# Altium project PROC154E3_SCH.PrjPcb (part 12 of 60)

## Sheet 19. SOC MCU RGMII & MMC & ADCs.SchDoc: SOC - MCU RGMII / MMC[0:1] / MCU ADC
size 513 x 386 mm; Project: PROC154E2(001)_SK_AM69; Issue: 1.0; RevCode: E3; Page Create Date: March  8, 1995; Variant Name: Core Design; Schematic Page Number: 19; Page Number: 19; Page Size: C; Comment: MISTRAL_TITLEBLK_CSIZE_1; Page Count: 62; Schematic Page Count: 62; Name: PROC154E2 001 SK AM69; DsnPath: C:\Users\danie\Downloads\sprr466c\PROC154E3_RP\PROC154E3_SCH.DSN; SchematicName: SCHEMATIC1; PageName: 19. SOC MCU RGMII & MMC & ADCs; PageSize: C; TopSchematic: True
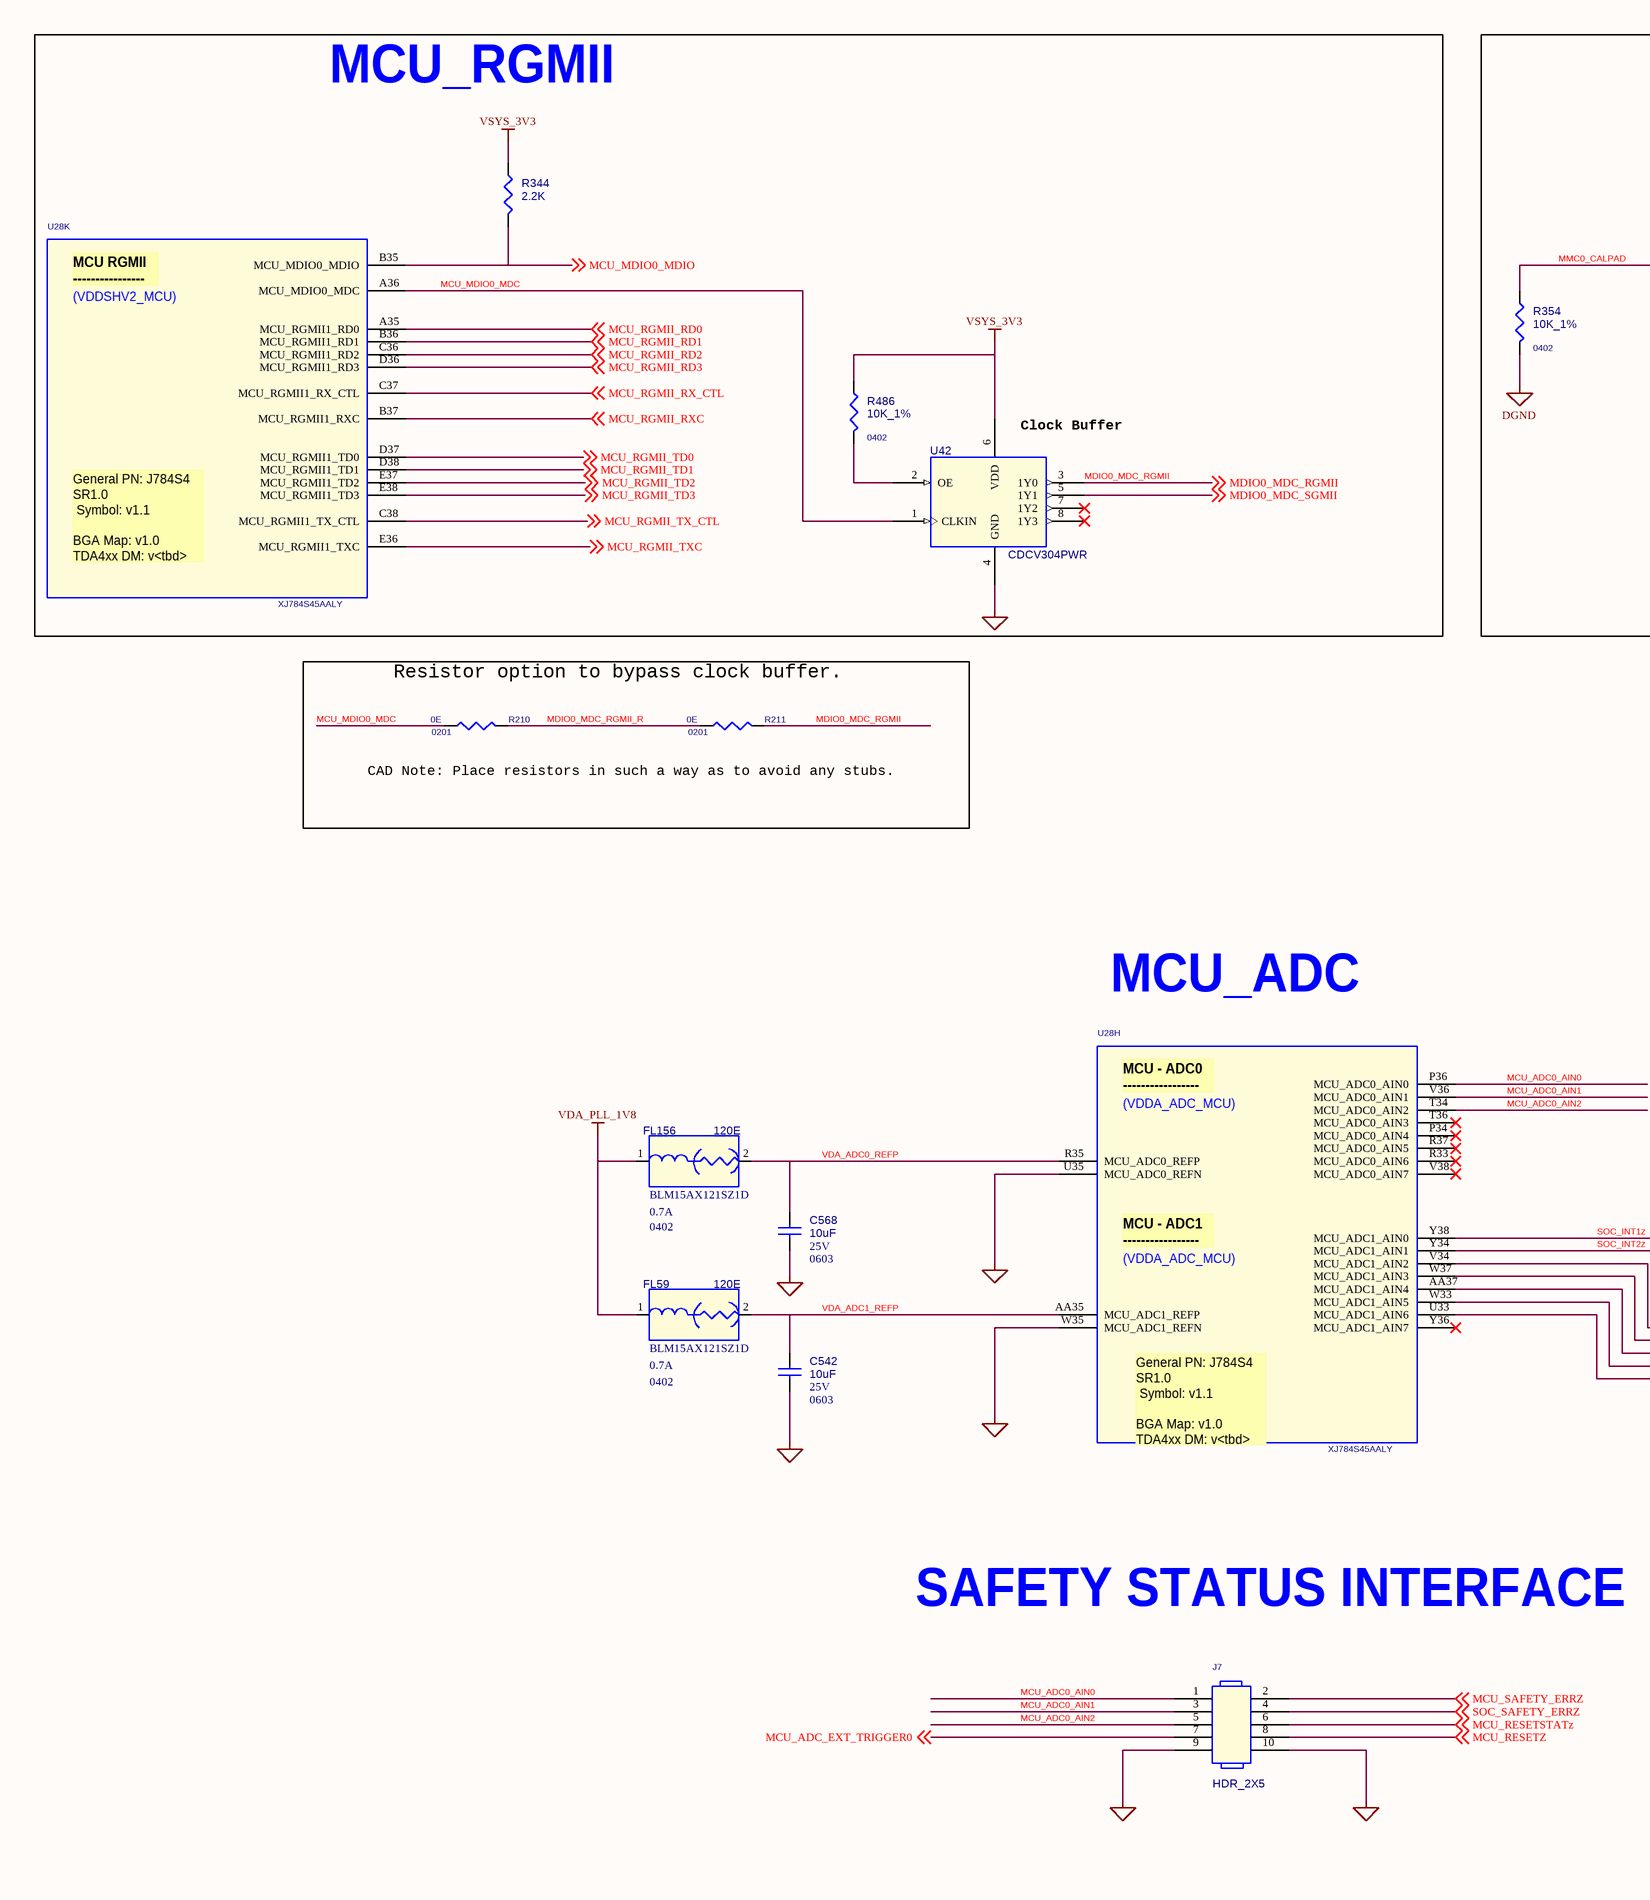
[diagram p27: 19. SOC MCU RGMII & MMC & ADCs.SchDoc, left]
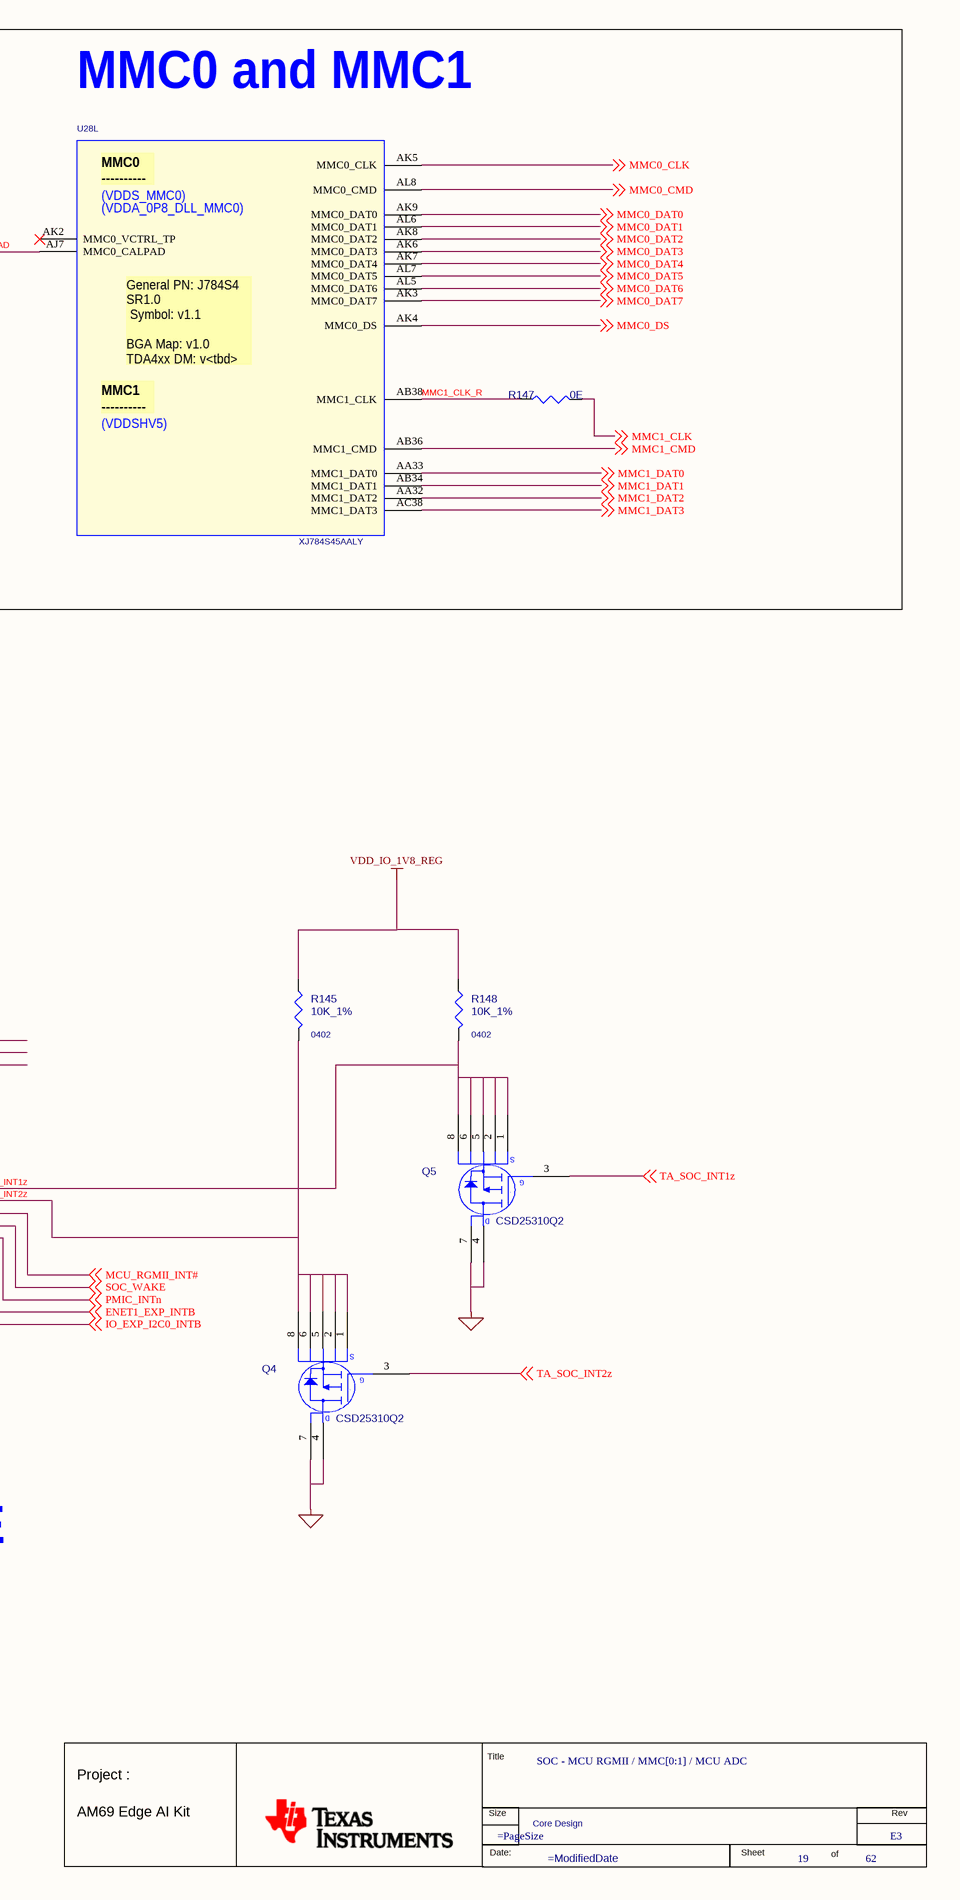
[diagram p28: 19. SOC MCU RGMII & MMC & ADCs.SchDoc, right]

### Parts
(Parts that share a designator on the sheet are numbered #1, #2 ... from top to bottom, then left to right.)
*#19  RevCode: E3  Title: SOC - MCU RGMII / MMC[0:1] / MCU ADC  Page Number: 19  Page Count: 62  Variant Name: Core Design  (hidden comment: MISTRAL_TITLEBLK_CSIZE_1)  (graphical)
C542  10uF  Voltage: 25V  Package: 0603  [CAP0603_1-25]
C568  10uF  Package: 0603  Voltage: 25V  [CAP0603_1-25]
FL59  120E  Mfr_part_number: BLM15AX121SZ1D  Package: 0402  SAT Current: 0.7A  [EMIFIL_BLM15A_0402_0-6]
FL156  120E  Mfr_part_number: BLM15AX121SZ1D  Package: 0402  SAT Current: 0.7A  [EMIFIL_BLM15A_0402_0-6]
J7  HDR_2X5  [HDR_5X2_100_S_S_9-7]
Q4  CSD25310Q2  [SON6_CSD17313Q2_80X80]
Q5  CSD25310Q2  [SON6_CSD17313Q2_80X80]
R145  10K_1%  Package: 0402  [RES0402_0-5]
R147  0E  [RES0402_0-5]
R148  10K_1%  Package: 0402  [RES0402_0-5]
R210  0E  Package: 0201  [RES0201_0-5]
R211  0E  Package: 0201  [RES0201_0-5]
R344  2.2K  [RES0201_0-5]
R354  10K_1%  Package: 0402  [RES0402_0-5]
R486  10K_1%  Package: 0402  [RES0402_0-5]
U28  XJ784S45AALY  [BGA1414_31-49_1230X1230_2-7]  (parts H,K,L of 26)
U42  CDCV304PWR  [TSSOP8_25-59_125X180_1-2]

### Blocks framed on the sheet
MCU_RGMII: R344 R486 U28 U42
MMC0 and MMC1: R147 R354 U28
Resistor option to bypass clock buffer.: R210 R211

### Nets
DGND: C542.2 C568.2 J7.9 J7.10 Q4.4(D1) Q4.7(D2) Q5.4(D1) Q5.7(D2) R354.2 U28.U35(MCU_ADC0_REFN) U28.W35(MCU_ADC1_REFN) U42.4(GND)  [project net VDD_CPU_HCPS_GOSNS]
VDA_PLL_1V8: FL59.1 FL156.1  [project net VDA_MCU_1V8]
VDD_IO_1V8_REG: R145.1 R148.1
VSYS_3V3: R344.1 R486.1 U42.6(VDD)  [project net V_3V3]
ENET1_EXP_INTB: U28.W33(MCU_ADC1_AIN5) ; off-sheet ENET1_EXP_INTB
IO_EXP_I2C0_INTB: U28.U33(MCU_ADC1_AIN6) ; off-sheet IO_EXP_I2C0_INTB
MCU_ADC0_AIN0: J7.1 U28.P36(MCU_ADC0_AIN0)
MCU_ADC0_AIN1: J7.3 U28.V36(MCU_ADC0_AIN1)
MCU_ADC0_AIN2: J7.5 U28.T34(MCU_ADC0_AIN2)
MCU_ADC_EXT_TRIGGER0: J7.7 ; off-sheet MCU_ADC_EXT_TRIGGER0
MCU_MDIO0_MDC: R210.2 U28.A36(MCU_MDIO0_MDC) U42.1(CLKIN)
MCU_MDIO0_MDIO: R344.2 U28.B35(MCU_MDIO0_MDIO) ; off-sheet MCU_MDIO0_MDIO
MCU_RESETSTATZ: J7.6 ; off-sheet MCU_RESETSTATz
MCU_RESETZ: J7.8 ; off-sheet MCU_RESETZ
MCU_RGMII_INT#: U28.V34(MCU_ADC1_AIN2) ; off-sheet MCU_RGMII_INT#
MCU_RGMII_RD0: U28.A35(MCU_RGMII1_RD0) ; off-sheet MCU_RGMII_RD0
MCU_RGMII_RD1: U28.B36(MCU_RGMII1_RD1) ; off-sheet MCU_RGMII_RD1
MCU_RGMII_RD2: U28.C36(MCU_RGMII1_RD2) ; off-sheet MCU_RGMII_RD2
MCU_RGMII_RD3: U28.D36(MCU_RGMII1_RD3) ; off-sheet MCU_RGMII_RD3
MCU_RGMII_RX_CTL: U28.C37(MCU_RGMII1_RX_CTL) ; off-sheet MCU_RGMII_RX_CTL
MCU_RGMII_RXC: U28.B37(MCU_RGMII1_RXC) ; off-sheet MCU_RGMII_RXC
MCU_RGMII_TD0: U28.D37(MCU_RGMII1_TD0) ; off-sheet MCU_RGMII_TD0
MCU_RGMII_TD1: U28.D38(MCU_RGMII1_TD1) ; off-sheet MCU_RGMII_TD1
MCU_RGMII_TD2: U28.E37(MCU_RGMII1_TD2) ; off-sheet MCU_RGMII_TD2
MCU_RGMII_TD3: U28.E38(MCU_RGMII1_TD3) ; off-sheet MCU_RGMII_TD3
MCU_RGMII_TX_CTL: U28.C38(MCU_RGMII1_TX_CTL) ; off-sheet MCU_RGMII_TX_CTL
MCU_RGMII_TXC: U28.E36(MCU_RGMII1_TXC) ; off-sheet MCU_RGMII_TXC
MCU_SAFETY_ERRZ: J7.2 ; off-sheet MCU_SAFETY_ERRZ
MDIO0_MDC_RGMII: R211.1 U42.3(1Y0) ; off-sheet MDIO0_MDC_RGMII
MDIO0_MDC_RGMII_R: R210.1 R211.2
MDIO0_MDC_SGMII: U42.5(1Y1) ; off-sheet MDIO0_MDC_SGMII
MMC0_CALPAD: R354.1 U28.AJ7(MMC0_CALPAD)
MMC0_CLK: U28.AK5(MMC0_CLK) ; off-sheet MMC0_CLK
MMC0_CMD: U28.AL8(MMC0_CMD) ; off-sheet MMC0_CMD
MMC0_DAT0: U28.AK9(MMC0_DAT0) ; off-sheet MMC0_DAT0
MMC0_DAT1: U28.AL6(MMC0_DAT1) ; off-sheet MMC0_DAT1
MMC0_DAT2: U28.AK8(MMC0_DAT2) ; off-sheet MMC0_DAT2
MMC0_DAT3: U28.AK6(MMC0_DAT3) ; off-sheet MMC0_DAT3
MMC0_DAT4: U28.AK7(MMC0_DAT4) ; off-sheet MMC0_DAT4
MMC0_DAT5: U28.AL7(MMC0_DAT5) ; off-sheet MMC0_DAT5
MMC0_DAT6: U28.AL5(MMC0_DAT6) ; off-sheet MMC0_DAT6
MMC0_DAT7: U28.AK3(MMC0_DAT7) ; off-sheet MMC0_DAT7
MMC0_DS: U28.AK4(MMC0_DS) ; off-sheet MMC0_DS
MMC1_CLK: R147.2 ; off-sheet MMC1_CLK
MMC1_CLK_R: R147.1 U28.AB38(MMC1_CLK)
MMC1_CMD: U28.AB36(MMC1_CMD) ; off-sheet MMC1_CMD
MMC1_DAT0: U28.AA33(MMC1_DAT0) ; off-sheet MMC1_DAT0
MMC1_DAT1: U28.AB34(MMC1_DAT1) ; off-sheet MMC1_DAT1
MMC1_DAT2: U28.AA32(MMC1_DAT2) ; off-sheet MMC1_DAT2
MMC1_DAT3: U28.AC38(MMC1_DAT3) ; off-sheet MMC1_DAT3
PMIC_INTn: U28.AA37(MCU_ADC1_AIN4) ; off-sheet PMIC_INTn
SOC_INT1z: Q5.1(S1) Q5.2(S2) Q5.5(S3) Q5.6(S4) Q5.8(S5) R148.2 U28.Y38(MCU_ADC1_AIN0)
SOC_INT2z: Q4.1(S1) Q4.2(S2) Q4.5(S3) Q4.6(S4) Q4.8(S5) R145.2 U28.Y34(MCU_ADC1_AIN1)
SOC_SAFETY_ERRZ: J7.4 ; off-sheet SOC_SAFETY_ERRZ
SOC_WAKE: U28.W37(MCU_ADC1_AIN3) ; off-sheet SOC_WAKE
TA_SOC_INT1z: Q5.3(G) ; off-sheet TA_SOC_INT1z
TA_SOC_INT2z: Q4.3(G) ; off-sheet TA_SOC_INT2z
VDA_ADC0_REFP: C568.1 FL156.2 U28.R35(MCU_ADC0_REFP)
VDA_ADC1_REFP: C542.1 FL59.2 U28.AA35(MCU_ADC1_REFP)
NetR486_2: R486.2 U42.2(OE)

Not connected (* = marked no-connect by the designer): U28 AK2(MMC0_VCTRL_TP)* P34(MCU_ADC0_AIN4)* R33(MCU_ADC0_AIN6)* R37(MCU_ADC0_AIN5)* T36(MCU_ADC0_AIN3)* V38(MCU_ADC0_AIN7)* Y36(MCU_ADC1_AIN7)*; U42 7(1Y2)* 8(1Y3)*

### Notes on the sheet
- (near U42) Clock Buffer
- CAD Note: Place resistors in such a way as to avoid any stubs.
- MCU_ADC
- SAFETY STATUS INTERFACE
- (in symbol J7AHPSoC-EVM_BGA1414, part H) MCU - ADC0 / -----------------; (VDDA_ADC_MCU); MCU - ADC1 / -----------------; General PN: J784S4 / SR1.0 / Symbol: v1.1 / BGA Map: v1.0 / TDA4xx DM: v<tbd>
- (in symbol J7AHPSoC-EVM_BGA1414, part K) MCU RGMII / ----------------; (VDDSHV2_MCU); General PN: J784S4 / SR1.0 / Symbol: v1.1 / BGA Map: v1.0 / TDA4xx DM: v<tbd>
- (in symbol J7AHPSoC-EVM_BGA1414, part L) MMC0 / ----------; (VDDS_MMC0); (VDDA_0P8_DLL_MMC0); General PN: J784S4 / SR1.0 / Symbol: v1.1 / BGA Map: v1.0 / TDA4xx DM: v<tbd>; MMC1 / ----------; (VDDSHV5)
- (in symbol MISTRAL_TITLEBLK_CSIZE_1) Title; Project :; Size; Rev; AM69 Edge AI Kit; Date:; Sheet; of
- (in symbol MOSFET_CSD25310Q2) S; D

### Library data of the parts
*#19 = MISTRAL_TITLEBLK_CSIZE_1: Issue: 1.0; Project: PROC154E2(001)_SK_AM69; Name: PROC154E2 001 SK AM69; Page Create Date: March  8, 1995; Page Size: =PageSize; Page Modify Date: =ModifiedDate; Schematic Page Count: 62; Schematic Page Number: 19
C542 = CAP_Dup1: CAP CERAMIC 10uF 25V 20% X5R 0603; Part Reference: C542; Mistral Part No: 120018070001-R; Mfr_name: MURATA; Mfr_part_number: ZRB18AR61E106ME01L; Part_type: CAPACITORS\CERAMIC; Direct Alternate_mfr_name: SAMSUNG; Direct Alternate_mfr_part_number: CL10X106MO8NRNC; Automotive Alternate_mfr_part_number: GRT188C81C106ME13D; Project: CABS_VME_DIO; Wattage: NA; Customs_HS_Code: 85322990; Custom_Duty: 15%; Value: 10uF; Tolerance: 20%; Distributor_name: DIGIKEY; Distributor_part_number: 490-10991-1-ND; Library Ref: CAP; Height: 1.20MM; Weight: 2mg; Temperature: -55°C+85°C; Datasheet: Y:\MIS_DATABASE\DATASHEETS\CAPACITORS\ZRB18AR61E106ME01L.PDF; Crtd /date: MANIRAJA/040718; Chkd/date: MANIRAJA/040718; MECHANICAL 3D STEP FILE: CAP0603_1-25; Footprint Ref: CAP0603_1-25; Library Path: Y:\MIS_DATABASE\Library\ALTIUM_TOOL\SCHEMATICS_PARTS\MS_DISCRETE_Library.schlib; Footprint Path: Y:\MIS_DATABASE\Library\ALTIUM_TOOL\PCB_FOOTPRINTS\Altium_Footprint_Lib.PcbLib; Automotive Alternate_mfr_name: MURATA; Manufacturer: MURATA; PCB Footprint: CAP0603_1-25
C568 = CAP_Dup1: CAP CERAMIC 10uF 25V 20% X5R 0603; Part Reference: C568; Automotive Alternate_mfr_part_number: GRT188C81C106ME13D; Automotive Alternate_mfr_name: MURATA; Direct Alternate_mfr_part_number: CL10X106MO8NRNC; Direct Alternate_mfr_name: SAMSUNG; Part_type: CAPACITORS\CERAMIC; Mfr_part_number: ZRB18AR61E106ME01L; Mistral Part No: 120018070001-R; Custom_Duty: 15%; Customs_HS_Code: 85322990; Wattage: NA; Project: CABS_VME_DIO; Value: 10uF; Footprint Path: Y:\MIS_DATABASE\Library\ALTIUM_TOOL\PCB_FOOTPRINTS\Altium_Footprint_Lib.PcbLib; Library Path: Y:\MIS_DATABASE\Library\ALTIUM_TOOL\SCHEMATICS_PARTS\MS_DISCRETE_Library.schlib; Footprint Ref: CAP0603_1-25; MECHANICAL 3D STEP FILE: CAP0603_1-25; Chkd/date: MANIRAJA/040718; Crtd /date: MANIRAJA/040718; Datasheet: Y:\MIS_DATABASE\DATASHEETS\CAPACITORS\ZRB18AR61E106ME01L.PDF; Temperature: -55°C+85°C; Weight: 2mg; Height: 1.20MM; Library Ref: CAP; Distributor_part_number: 490-10991-1-ND; Distributor_name: DIGIKEY; Tolerance: 20%; Mfr_name: MURATA; Manufacturer: MURATA; PCB Footprint: CAP0603_1-25
FL59 = EMIFILTER_IND: IND FERRITE BEAD CHIP 120E 700mA 0402; Part Reference: FL59; Manufacturer: MURATA; Automotive Alternate_mfr_part_number: MPZ1608S121ATDH5; Automotive Alternate_mfr_name: TDK; Direct Alternate_mfr_part_number: MPZ1608S121ATAH0; Mistral Part No: 130022010017-R; Part_type: INDUCTOR; Project: J7AHP_PROTO_BRD; Tolerance: 25%; Voltage: NA; Customs_HS_Code: 85437099; Custom_Duty: 24%; Value: 120E; PCB Footprint: EMIFIL_BLM15A_0402_0-6; Direct Alternate_mfr_name: TDK; Footprint Ref: EMIFIL_BLM15A_0402_0-6; Mfr_name: MURATA; Wattage: NA; Distributor_name: DIGIKEY; Distributor_part_number: 490-16510-1-ND; Library Ref: EMIFILTER_IND; Height: 0.55MM; Weight: 1mg; Temperature: -55°C+125°C; Datasheet: Y:\MIS_DATABASE\DATASHEETS\DISCRETES\INDUCTORS\BLM15-SZ1D-SER.PDF; Crtd /date: TAMILARASU/170122; Chkd/date: MANIRAJA/170122; MECHANICAL 3D STEP FILE: EMIFIL_BLM15A_0402_0-6; Library Path: Y:\MIS_DATABASE\Library\ALTIUM_TOOL\SCHEMATICS_PARTS\MS_FILTER_Library.schlib; Footprint Path: Y:\MIS_DATABASE\Library\ALTIUM_TOOL\PCB_FOOTPRINTS\Altium_Footprint_Lib.PcbLib
FL156 = EMIFILTER_IND: IND FERRITE BEAD CHIP 120E 700mA 0402; Part Reference: FL156; Manufacturer: MURATA; Automotive Alternate_mfr_part_number: MPZ1608S121ATDH5; Automotive Alternate_mfr_name: TDK; Direct Alternate_mfr_part_number: MPZ1608S121ATAH0; Mistral Part No: 130022010017-R; Part_type: INDUCTOR; Project: J7AHP_PROTO_BRD; Tolerance: 25%; Voltage: NA; Customs_HS_Code: 85437099; Custom_Duty: 24%; Value: 120E; PCB Footprint: EMIFIL_BLM15A_0402_0-6; Direct Alternate_mfr_name: TDK; Footprint Ref: EMIFIL_BLM15A_0402_0-6; Mfr_name: MURATA; Wattage: NA; Distributor_name: DIGIKEY; Distributor_part_number: 490-16510-1-ND; Library Ref: EMIFILTER_IND; Height: 0.55MM; Weight: 1mg; Temperature: -55°C+125°C; Datasheet: Y:\MIS_DATABASE\DATASHEETS\DISCRETES\INDUCTORS\BLM15-SZ1D-SER.PDF; Crtd /date: TAMILARASU/170122; Chkd/date: MANIRAJA/170122; MECHANICAL 3D STEP FILE: EMIFIL_BLM15A_0402_0-6; Library Path: Y:\MIS_DATABASE\Library\ALTIUM_TOOL\SCHEMATICS_PARTS\MS_FILTER_Library.schlib; Footprint Path: Y:\MIS_DATABASE\Library\ALTIUM_TOOL\PCB_FOOTPRINTS\Altium_Footprint_Lib.PcbLib
J7 = HEADER_5X2: CON HDR 2X5 2.54MM PITCH ST SMD; Part Reference: J7; Part_type: CONNECTOR\HEADERS; Mfr_part_number: TSM-105-01-L-DV; Mfr_name: SAMTEC; Mistral Part No: 150009030265-R; Custom_Duty: 24%; Customs_HS_Code: 85369090; Wattage: NA; Project: SMART VIEW_NVR; Value: HDR_2X5; MECHANICAL 3D STEP FILE: HDR_5X2_100_S_S_9-7; Chkd/date: VASANTHA/220317; Crtd /date: MANIRAJA/210317; Datasheet: Y:\MIS_DATABASE\DATASHEETS\CONNECTORS\TSM-103-02-L-DV.PDF; Temperature: -55°C+125°C; Weight: NA; Height: 9.65MM; Library Ref: HEADER_5X2; Distributor_part_number: SAM8984-ND; Distributor_name: DIGIKEY; Package: SMD; Voltage: NA; Tolerance: NA; PCB Footprint: HDR_5X2_100_S_S_9-7
Q4 = MOSFET_CSD25310Q2: IC MOSFET P-CHANNEL WSON6; Part Reference: Q4; Part_type: ICS\POWER\MOSFET; Mfr_name: TEXAS INSTRUMENTS; Mistral Part No: 142015120011-R; Custom_Duty: 15%; Customs_HS_Code: 85423100; Wattage: NA; Project: DUET BOARD; Value: CSD25310Q2; Chkd/date: VASANTHA/191215; Crtd /date: VASANTHA/191215; Datasheet: Y:\MIS_DATABASE\DATASHEETS\DISCRETES\TRANSISTORS_FETS\CSD25310Q2.PDF; Temperature: -55°C+150°C; Weight: NA; Height: 0.85MM; Library Ref: MOSFET_CSD25310Q2; Distributor_part_number: 296-38915-1-ND; Distributor_name: DIGIKEY; Package: WSON6; Voltage: NA; Tolerance: NA; Mfr_part_number: CSD25310Q2; PCB Footprint: SON6_CSD17313Q2_80X80
Q5 = MOSFET_CSD25310Q2: IC MOSFET P-CHANNEL WSON6; Part Reference: Q5; Part_type: ICS\POWER\MOSFET; Mfr_name: TEXAS INSTRUMENTS; Mistral Part No: 142015120011-R; Custom_Duty: 15%; Customs_HS_Code: 85423100; Wattage: NA; Project: DUET BOARD; Value: CSD25310Q2; Chkd/date: VASANTHA/191215; Crtd /date: VASANTHA/191215; Datasheet: Y:\MIS_DATABASE\DATASHEETS\DISCRETES\TRANSISTORS_FETS\CSD25310Q2.PDF; Temperature: -55°C+150°C; Weight: NA; Height: 0.85MM; Library Ref: MOSFET_CSD25310Q2; Distributor_part_number: 296-38915-1-ND; Distributor_name: DIGIKEY; Package: WSON6; Voltage: NA; Tolerance: NA; Mfr_part_number: CSD25310Q2; PCB Footprint: SON6_CSD17313Q2_80X80
R145 = RESISTOR_Dup2: RES 10K 1/16W 1% 0402; Part Reference: R145; Part_type: RESISTORS\FIXED; Mfr_part_number: RC0402FR-0710KL; Mfr_name: YAGEO AMERICA; Mistral Part No: 110015090015-R; Custom_Duty: 15%; Customs_HS_Code: 85332119; Voltage: NA; Project: VOCERA; Value: 10K_1%; Footprint Path: Y:\MIS_DATABASE\Library\ALTIUM_TOOL\PCB_FOOTPRINTS\Altium_Footprint_Lib.PcbLib; Library Path: Y:\MIS_DATABASE\Library\ALTIUM_TOOL\SCHEMATICS_PARTS\MS_DISCRETE_Library.schlib; MECHANICAL 3D STEP FILE: RES0402_0-5; Chkd/date: VASANTHA/201216; Crtd /date: GEETHA/290506; Datasheet: Y:\MIS_DATABASE\DATASHEETS\RESISTORS\RCXXXXL-SER_MAR18.PDF; Temperature: -55°C+155°C; Weight: 0.65mg; Height: 0.40MM; Library Ref: RESISTOR; Distributor_part_number: 311-10.0KLRTR-ND; Distributor_name: DIGIKEY; Wattage: 1/16W; Tolerance: 1%; Footprint Ref: RES0402_0-5; Manufacturer: YAGEO AMERICA; PCB Footprint: RES0402_0-5
R147 = RESISTOR_Dup2: RES 0E 1/10W JUMPER 0402; Part Reference: R147; Manufacturer: PANASONIC-ECG; Mistral Part No: 110018030052-R; Mfr_part_number: ERJ-2GE0R00X; Part_type: RESISTORS\FIXED; IBISSP_MODLES: VALUE REPEATING 2 TIME; Project: AEGIS POM; Tolerance: NA; Customs_HS_Code: 85332119; Custom_Duty: 15%; SIGNAL_MODEL: RESISTOR_RES0402_0-5_0E_0E; Value: 0E; Footprint Path: Y:\MIS_DATABASE\Library\ALTIUM_TOOL\PCB_FOOTPRINTS\Altium_Footprint_Lib.PcbLib; Library Path: Y:\MIS_DATABASE\Library\ALTIUM_TOOL\SCHEMATICS_PARTS\MS_DISCRETE_Library.schlib; MECHANICAL 3D STEP FILE: RES0402_0-5; Footprint Ref: RES0402_0-5; Mfr_name: PANASONIC-ECG; Voltage: NA; Wattage: 1/10W; Package: 0402; Distributor_name: DIGIKEY; Distributor_part_number: P0.0JCT-ND; Library Ref: RESISTOR; Height: 0.40MM; Weight: 0.8mg; Temperature: -55°C+155°C; Datasheet: Y:\MIS_DATABASE\DATASHEETS\RESISTORS\PAN-ERJSER_NOV17.PDF; Crtd /date: NAVEED/201014; Chkd/date: VASANTHA/061216; PCB Footprint: RES0402_0-5
R148 = RESISTOR_Dup2: RES 10K 1/16W 1% 0402; Part Reference: R148; Manufacturer: YAGEO AMERICA; Mistral Part No: 110015090015-R; Mfr_part_number: RC0402FR-0710KL; Part_type: RESISTORS\FIXED; Project: VOCERA; Voltage: NA; Customs_HS_Code: 85332119; Custom_Duty: 15%; Value: 10K_1%; Footprint Ref: RES0402_0-5; Mfr_name: YAGEO AMERICA; Tolerance: 1%; Wattage: 1/16W; Distributor_name: DIGIKEY; Distributor_part_number: 311-10.0KLRTR-ND; Library Ref: RESISTOR; Height: 0.40MM; Weight: 0.65mg; Temperature: -55°C+155°C; Datasheet: Y:\MIS_DATABASE\DATASHEETS\RESISTORS\RCXXXXL-SER_MAR18.PDF; Crtd /date: GEETHA/290506; Chkd/date: VASANTHA/201216; MECHANICAL 3D STEP FILE: RES0402_0-5; Library Path: Y:\MIS_DATABASE\Library\ALTIUM_TOOL\SCHEMATICS_PARTS\MS_DISCRETE_Library.schlib; Footprint Path: Y:\MIS_DATABASE\Library\ALTIUM_TOOL\PCB_FOOTPRINTS\Altium_Footprint_Lib.PcbLib; PCB Footprint: RES0402_0-5
R210 = RESISTOR: RES 0E 1/20W 5% 0201; Part Reference: R210; Mistral Part No: 110010070067-R; Mfr_name: YAGEO AMERICA; Mfr_part_number: RC0201JR-070RL; Part_type: RESISTORS\FIXED; Project: PB_BUGBASE; Voltage: NA; Customs_HS_Code: 85332119; Custom_Duty: 15%; Value: 0E; Footprint Ref: RES0201_0-5; Tolerance: 5%; Wattage: 1/20W; Distributor_name: DIGIKEY; Distributor_part_number: 311-0.0NCT-ND; Library Ref: RESISTOR; Height: 0.26MM; Weight: 0.17mg; Temperature: -55°C+125°C; Datasheet: Y:\MIS_DATABASE\DATASHEETS\RESISTORS\RCXXXXL-SER_MAR18.PDF; Crtd /date: MUDDU/120710; Chkd/date: NAVEED/301214; MECHANICAL 3D STEP FILE: RES0201_0-5; Library Path: Y:\MIS_DATABASE\Library\ALTIUM_TOOL\SCHEMATICS_PARTS\MS_DISCRETE_Library.schlib; Footprint Path: Y:\MIS_DATABASE\Library\ALTIUM_TOOL\PCB_FOOTPRINTS\Altium_Footprint_Lib.PcbLib; Manufacturer: YAGEO AMERICA; PCB Footprint: RES0201_0-5
R211 = RESISTOR: RES 0E 1/20W 5% 0201; Part Reference: R211; Manufacturer: YAGEO AMERICA; Mistral Part No: 110010070067-R; Mfr_part_number: RC0201JR-070RL; Part_type: RESISTORS\FIXED; Project: PB_BUGBASE; Voltage: NA; Customs_HS_Code: 85332119; Custom_Duty: 15%; Value: 0E; Footprint Ref: RES0201_0-5; Mfr_name: YAGEO AMERICA; Tolerance: 5%; Wattage: 1/20W; Distributor_name: DIGIKEY; Distributor_part_number: 311-0.0NCT-ND; Library Ref: RESISTOR; Height: 0.26MM; Weight: 0.17mg; Temperature: -55°C+125°C; Datasheet: Y:\MIS_DATABASE\DATASHEETS\RESISTORS\RCXXXXL-SER_MAR18.PDF; Crtd /date: MUDDU/120710; Chkd/date: NAVEED/301214; MECHANICAL 3D STEP FILE: RES0201_0-5; Library Path: Y:\MIS_DATABASE\Library\ALTIUM_TOOL\SCHEMATICS_PARTS\MS_DISCRETE_Library.schlib; Footprint Path: Y:\MIS_DATABASE\Library\ALTIUM_TOOL\PCB_FOOTPRINTS\Altium_Footprint_Lib.PcbLib; PCB Footprint: RES0201_0-5
R344 = RESISTOR_Dup2: RES 2.2K 1/20W 5% 0201; Part Reference: R344; Manufacturer: YAGEO AMERICA; Part_type: RESISTORS\FIXED; Mfr_part_number: RC0201JR-072K2L; Mistral Part No: 110009030427-R; Custom_Duty: 15%; Customs_HS_Code: 85332119; Voltage: NA; Project: GOLDEN-I LITE; Value: 2.2K; PCB Footprint: RES0201_0-5; Footprint Path: Y:\MIS_DATABASE\Library\ALTIUM_TOOL\PCB_FOOTPRINTS\Altium_Footprint_Lib.PcbLib; Library Path: Y:\MIS_DATABASE\Library\ALTIUM_TOOL\SCHEMATICS_PARTS\MS_DISCRETE_Library.schlib; MECHANICAL 3D STEP FILE: RES0201_0-5; Chkd/date: MANIRAJA/050517; Crtd /date: MANIRAJA/050517; Datasheet: Y:\MIS_DATABASE\DATASHEETS\RESISTORS\RCXXXXL-SER_MAR18.PDF; Temperature: -55°C+125°C; Weight: 0.17mg; Height: 0.26MM; Library Ref: RESISTOR; Distributor_part_number: 311-2.2KNCT-ND; Distributor_name: DIGIKEY; Package: 0201; Wattage: 1/20W; Tolerance: 5%; Mfr_name: YAGEO AMERICA; Footprint Ref: RES0201_0-5
R354 = RESISTOR_Dup2: RES 10K 1/16W 1% 0402; Part Reference: R354; Manufacturer: YAGEO AMERICA; Mistral Part No: 110015090015-R; Mfr_part_number: RC0402FR-0710KL; Part_type: RESISTORS\FIXED; Project: VOCERA; Voltage: NA; Customs_HS_Code: 85332119; Custom_Duty: 15%; Value: 10K_1%; Footprint Ref: RES0402_0-5; Mfr_name: YAGEO AMERICA; Tolerance: 1%; Wattage: 1/16W; Distributor_name: DIGIKEY; Distributor_part_number: 311-10.0KLRTR-ND; Library Ref: RESISTOR; Height: 0.40MM; Weight: 0.65mg; Temperature: -55°C+155°C; Datasheet: Y:\MIS_DATABASE\DATASHEETS\RESISTORS\RCXXXXL-SER_MAR18.PDF; Crtd /date: GEETHA/290506; Chkd/date: VASANTHA/201216; MECHANICAL 3D STEP FILE: RES0402_0-5; Library Path: Y:\MIS_DATABASE\Library\ALTIUM_TOOL\SCHEMATICS_PARTS\MS_DISCRETE_Library.schlib; Footprint Path: Y:\MIS_DATABASE\Library\ALTIUM_TOOL\PCB_FOOTPRINTS\Altium_Footprint_Lib.PcbLib; PCB Footprint: RES0402_0-5
R486 = RESISTOR_Dup2: RES 10K 1/16W 1% 0402; Part Reference: R486; Part_type: RESISTORS\FIXED; Mfr_part_number: RC0402FR-0710KL; Mfr_name: YAGEO AMERICA; Mistral Part No: 110015090015-R; Custom_Duty: 15%; Customs_HS_Code: 85332119; Voltage: NA; Project: VOCERA; Value: 10K_1%; Footprint Path: Y:\MIS_DATABASE\Library\ALTIUM_TOOL\PCB_FOOTPRINTS\Altium_Footprint_Lib.PcbLib; Library Path: Y:\MIS_DATABASE\Library\ALTIUM_TOOL\SCHEMATICS_PARTS\MS_DISCRETE_Library.schlib; MECHANICAL 3D STEP FILE: RES0402_0-5; Chkd/date: VASANTHA/201216; Crtd /date: GEETHA/290506; Datasheet: Y:\MIS_DATABASE\DATASHEETS\RESISTORS\RCXXXXL-SER_MAR18.PDF; Temperature: -55°C+155°C; Weight: 0.65mg; Height: 0.40MM; Library Ref: RESISTOR; Distributor_part_number: 311-10.0KLRTR-ND; Distributor_name: DIGIKEY; Wattage: 1/16W; Tolerance: 1%; Footprint Ref: RES0402_0-5; Manufacturer: YAGEO AMERICA; PCB Footprint: RES0402_0-5
U28 = J7AHPSoC-EVM_BGA1414: IC AM69 SoC EVM MICROPROCESSOR BGA1414; Part Reference: U28; Manufacturer: TEXAS INSTRUMENTS; Mistral Part No: 141230020002; Part_type: ICS\DIGITAL\MICROPROCESSOR; SPLIT_INST: TRUE; SWAP_INFO: (S1+S2+S3+S4+S5+S6+S7+S8+S9+S10+S11+S12+S13+S14+S15+S16+S17+S18+S19+S20+S21+S22+S23+S24+S25+S26); Project: TI_J7AHP SK_BRD; Tolerance: NA; Customs_HS_Code: 85423100; Custom_Duty: 15%; Value: XJ784S45AALY; Footprint Ref: BGA1414_31-49_1230X1230_2-7; Mfr_name: TEXAS INSTRUMENTS; Mfr_part_number: XJ784S45AALY; Voltage: NA; Wattage: NA; Package: BGA1414; Distributor_name: NA; Distributor_part_number: NA; Library Ref: J7AHPSoC-EVM_BGA1414; Height: 2.70MM; Weight: NA; Temperature: NA; Datasheet: Y:\MIS_DATABASE\DATASHEETS\ICS\DIGITAL\MICROCONTROLLER\J7AHP-SoC-EVM.PDF; Crtd /date: ALVY/141221; Chkd/date: MANIRAJA/151221; RoHS: NA; MECHANICAL 3D STEP FILE: BGA1414_31-49_1230X1230_2-7; Library Path: Y:\MIS_DATABASE\Library\ALTIUM_TOOL\SCHEMATICS_PARTS\MS_MICROPROCESSOR_Library.schlib; Footprint Path: Y:\MIS_DATABASE\Library\ALTIUM_TOOL\PCB_FOOTPRINTS\Altium_Footprint_Lib.PcbLib; PCB Footprint: BGA1414_31-49_1230X1230_2-7
U42 = CDCV304PW_TSSOP8: IC 200MHz CLOCK BUFFER PCI-X COMPLIANT TSSOP8; Part Reference: U42; Part_type: ICS\DIGITAL\COMBINATIONAL; Mfr_name: TEXAS INSTRUMENTS; Mistral Part No: 141009030060-R; Custom_Duty: 15%; Customs_HS_Code: 85423100; Wattage: NA; Project: SMART VIEW_IP CAMERA; Value: CDCV304PWR; Footprint Path: Y:\MIS_DATABASE\Library\ALTIUM_TOOL\PCB_FOOTPRINTS\Altium_Footprint_Lib.PcbLib; Library Path: Y:\MIS_DATABASE\Library\ALTIUM_TOOL\SCHEMATICS_PARTS\MS_COMBINATIONAL_Library.schlib; MECHANICAL 3D STEP FILE: TSSOP8_25-59_125X180_1-2; Chkd/date: VASANTHA/090217; Crtd /date: MANIRAJA/090217; Datasheet: Y:\MIS_DATABASE\DATASHEETS\ICS\DIGITAL\COMBINATIONAL\CDCV304-OCT2017.PDF; Temperature: -40°C+85°C; Weight: 39mg; Height: 1.20MM; Library Ref: CDCV304PW_TSSOP8; Distributor_part_number: 296-9436-1-ND; Distributor_name: DIGIKEY; Package: TSSOP8; Voltage: NA; Tolerance: NA; Mfr_part_number: CDCV304PWR; Footprint Ref: TSSOP8_25-59_125X180_1-2; PCB Footprint: TSSOP8_25-59_125X180_1-2

## Sheet 20. SOC DEBUG.SchDoc: SOC - DEBUG & VMON
size 513 x 386 mm; Project: PROC154E2(001)_SK_AM69; Issue: 1.0; RevCode: E3; Page Create Date: March  8, 1995; Variant Name: Core Design; Schematic Page Number: 20; Page Number: 20; Page Size: C; Comment: MISTRAL_TITLEBLK_CSIZE_1; Page Count: 62; Schematic Page Count: 62; Name: PROC154E2 001 SK AM69; DsnPath: C:\Users\danie\Downloads\sprr466c\PROC154E3_RP\PROC154E3_SCH.DSN; SchematicName: SCHEMATIC1; PageName: 20. SOC DEBUG; PageSize: C; TopSchematic: True
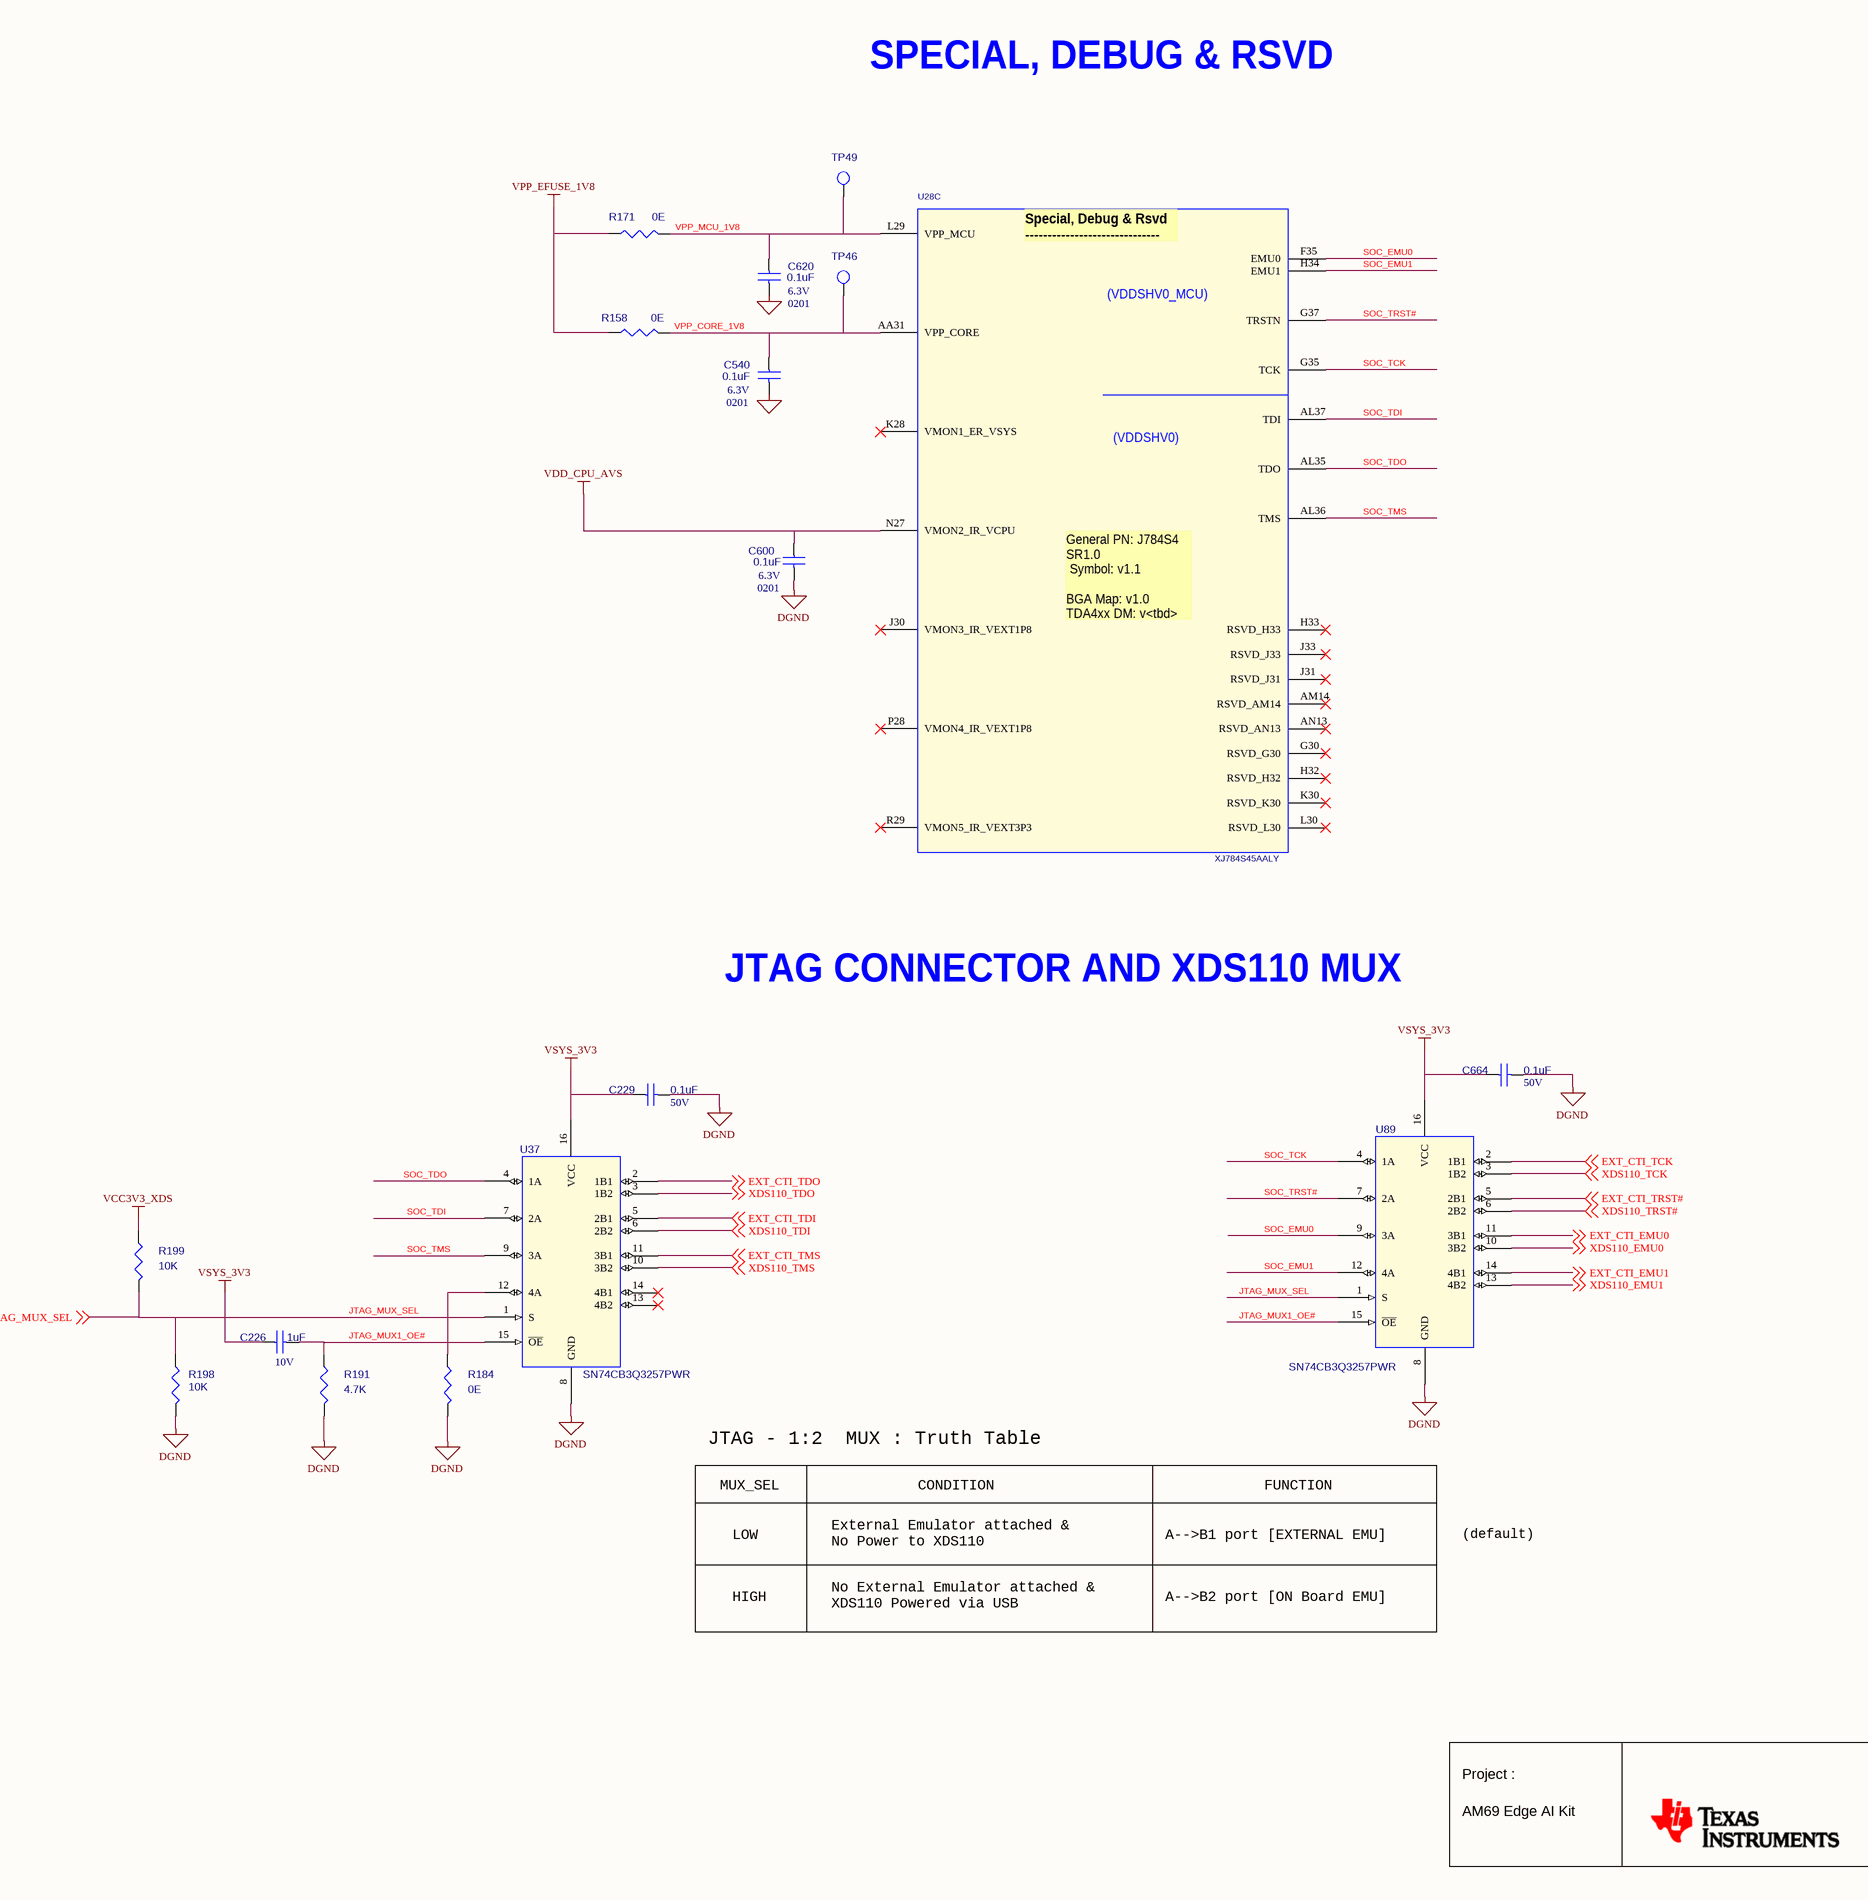
[diagram p29: 20. SOC DEBUG.SchDoc, left]
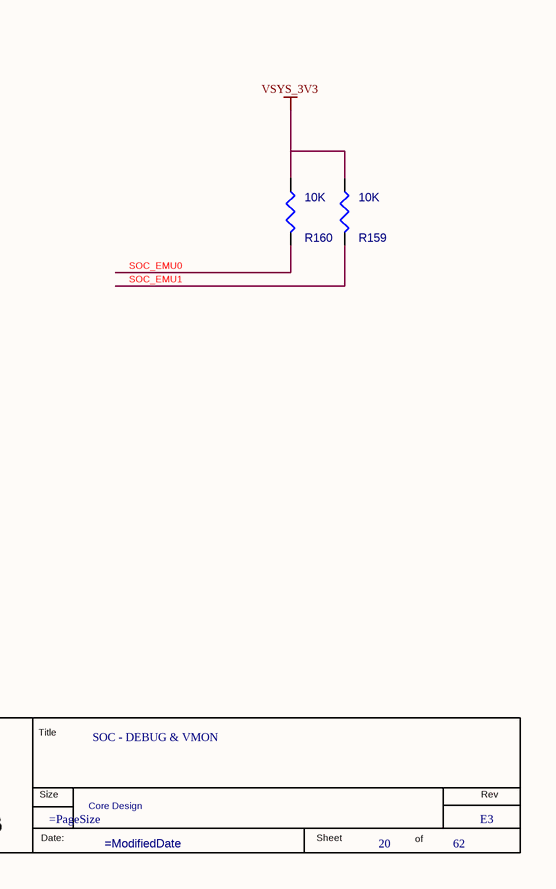
[diagram p30: 20. SOC DEBUG.SchDoc, right]

### Parts
(Parts that share a designator on the sheet are numbered #1, #2 ... from top to bottom, then left to right.)
*#20  RevCode: E3  Title: SOC - DEBUG & VMON  Page Number: 20  Page Count: 62  Variant Name: Core Design  (hidden comment: MISTRAL_TITLEBLK_CSIZE_1)  (graphical)
C226  1uF  Voltage: 10V  [CAP0402_0-75]
C229  0.1uF  Voltage: 50V  [CAP0402_0-75]
C540  0.1uF  Package: 0201  Voltage: 6.3V  [CAP0201_0-5]
C600  0.1uF  Voltage: 6.3V  Package: 0201  [CAP0201_0-5]
C620  0.1uF  Voltage: 6.3V  Package: 0201  [CAP0201_0-5]
C664  0.1uF  Voltage: 50V  [CAP0402_0-75]
R158  0E  [RES0603_0-75]
R159  10K  [RES0402_0-5]
R160  10K  [RES0402_0-5]
R171  0E  [RES0603_0-75]
R184  0E  [RES0402_0-5]
R191  4.7K  [RES0402_0-5]
R198  10K  [RES0402_0-5]
R199  10K  [RES0402_0-5]
TP46  TP30_SMD  [TP30_SMD]  (value not drawn)
TP49  TP30_SMD  [TP30_SMD]  (value not drawn)
U28  XJ784S45AALY  [BGA1414_31-49_1230X1230_2-7]  (part C of 26)
U37  SN74CB3Q3257PWR  [TSSOP16_25-59_205X180]
U89  SN74CB3Q3257PWR  [TSSOP16_25-59_205X180]

### Nets
DGND: C229.2 C540.2 C600.2 C620.2 C664.2 R184.2 R191.2 R198.2 U37.8(GND) U89.8(GND)  [project net VDD_CPU_HCPS_GOSNS]
VCC3V3_XDS: R199.1
VDD_CPU_AVS: C600.1 U28.N27(VMON2_IR_VCPU)  [project net VDD_CPU_HCPS_VOSNS]
VPP_EFUSE_1V8: R158.2 R171.1
VSYS_3V3: C226.1 C229.1 C664.1 R159.1 R160.1 U37.16(VCC) U89.16(VCC)  [project net V_3V3]
EXT_CTI_EMU0: U89.11(3B1) ; off-sheet EXT_CTI_EMU0
EXT_CTI_EMU1: U89.14(4B1) ; off-sheet EXT_CTI_EMU1
EXT_CTI_TCK: U89.2(1B1) ; off-sheet EXT_CTI_TCK
EXT_CTI_TDI: U37.5(2B1) ; off-sheet EXT_CTI_TDI
EXT_CTI_TDO: U37.2(1B1) ; off-sheet EXT_CTI_TDO
EXT_CTI_TMS: U37.11(3B1) ; off-sheet EXT_CTI_TMS
EXT_CTI_TRST#: U89.5(2B1) ; off-sheet EXT_CTI_TRST#
JTAG_MUX1_OE#: C226.2 R191.1 U37.15(~{OE}) U89.15(~{OE})
JTAG_MUX_SEL: R198.1 R199.2 U37.1(S) U89.1(S) ; off-sheet JTAG_MUX_SEL
SOC_EMU0: R160.2 U28.F35(EMU0) U89.9(3A)
SOC_EMU1: R159.2 U28.H34(EMU1) U89.12(4A)
SOC_TCK: U28.G35(TCK) U89.4(1A)
SOC_TDI: U28.AL37(TDI) U37.7(2A)
SOC_TDO: U28.AL35(TDO) U37.4(1A)
SOC_TMS: U28.AL36(TMS) U37.9(3A)
SOC_TRST#: U28.G37(TRSTN) U89.7(2A)
VPP_CORE_1V8: C540.1 R158.1 TP46.1(TP) U28.AA31(VPP_CORE)
VPP_MCU_1V8: C620.1 R171.2 TP49.1(TP) U28.L29(VPP_MCU)
XDS110_EMU0: U89.10(3B2) ; off-sheet XDS110_EMU0
XDS110_EMU1: U89.13(4B2) ; off-sheet XDS110_EMU1
XDS110_TCK: U89.3(1B2) ; off-sheet XDS110_TCK
XDS110_TDI: U37.6(2B2) ; off-sheet XDS110_TDI
XDS110_TDO: U37.3(1B2) ; off-sheet XDS110_TDO
XDS110_TMS: U37.10(3B2) ; off-sheet XDS110_TMS
XDS110_TRST#: U89.6(2B2) ; off-sheet XDS110_TRST#
NetR184_1: R184.1 U37.12(4A)

Not connected (* = marked no-connect by the designer): U28 AM14(RSVD_AM14)* AN13(RSVD_AN13)* G30(RSVD_G30)* H32(RSVD_H32)* H33(RSVD_H33)* J30(VMON3_IR_VEXT1P8)* J31(RSVD_J31)* J33(RSVD_J33)* K28(VMON1_ER_VSYS)* K30(RSVD_K30)* L30(RSVD_L30)* P28(VMON4_IR_VEXT1P8)* R29(VMON5_IR_VEXT3P3)*; U37 13(4B2)* 14(4B1)*

### Notes on the sheet
- SPECIAL, DEBUG & RSVD
- JTAG CONNECTOR AND XDS110 MUX
- JTAG - 1:2  MUX : Truth Table
- MUX_SEL
- External Emulator attached &
  No Power to XDS110
- CONDITION
- FUNCTION
- LOW
- No External Emulator attached &
  XDS110 Powered via USB
- A-->B1 port [EXTERNAL EMU]
- (default)
- HIGH
- A-->B2 port [ON Board EMU]
- (in symbol J7AHPSoC-EVM_BGA1414, part C) Special, Debug & Rsvd / ------------------------------; (VDDSHV0_MCU); (VDDSHV0); General PN: J784S4 / SR1.0 / Symbol: v1.1 / BGA Map: v1.0 / TDA4xx DM: v<tbd>
- (in symbol MISTRAL_TITLEBLK_CSIZE_1) Title; Project :; Size; Rev; AM69 Edge AI Kit; Date:; Sheet; of

### Library data of the parts
*#20 = MISTRAL_TITLEBLK_CSIZE_1: as *#19 on sheet 19. SOC MCU RGMII & MMC & ADCs; Page Create Date: March  8, 1995; Page Size: =PageSize; Page Modify Date: =ModifiedDate; Schematic Page Count: 62; Schematic Page Number: 20
C226 = CAP_Dup1: CAP CERAMIC 1uF 10V 10% X7S AUTO 0402; Part Reference: C226; Mistral Part No: 120018090021-R; Mfr_name: MURATA; Mfr_part_number: GCM155C71A105KE38D; Part_type: CAPACITORS\CERAMIC; Direct Alternate_mfr_name: YAGEO AMERICA; Direct Alternate_mfr_part_number: CC0402KRX5R7BB105; Automotive Alternate_mfr_name: TAIYO YUDEN; Automotive Alternate_mfr_part_number: EMK105BJ105KVHF; Manufacturer: TDK CORPORATION; Project: SMART-M_SCRIPTALK_PB; Wattage: NA; Customs_HS_Code: 85322990; Custom_Duty: 15%; Value: 1uF; PCB Footprint: CAP0402_0-75; Tolerance: 10%; Package: 0402; Distributor_name: DIGIKEY; Distributor_part_number: 490-13409-1-ND; Height: 0.70MM; Weight: 6mg; Temperature: -55°C+125°C; Datasheet: Y:\MIS_DATABASE\DATASHEETS\CAPACITORS\MURATA-GCM-SER.PDF; Crtd /date: ALVY/100918; Chkd/date: MANIRAJA/100918; Library Ref: CAP; MECHANICAL 3D STEP FILE: CAP0402_0-75; Footprint Ref: CAP0402_0-75; Library Path: Y:\MIS_DATABASE\Library\ALTIUM_TOOL\SCHEMATICS_PARTS\MS_DISCRETE_Library.schlib; Footprint Path: Y:\MIS_DATABASE\Library\ALTIUM_TOOL\PCB_FOOTPRINTS\Altium_Footprint_Lib.PcbLib
C229 = CAP_Dup1: CAP CERAMIC 0.1uF 50V 10% X7R 0402; Part Reference: C229; Manufacturer: MURATA; Mistral Part No: 120011100014-R; Mfr_part_number: GRM155R71H104KE14D; Part_type: CAPACITORS\CERAMIC; Direct Alternate_mfr_name: TDK; Direct Alternate_mfr_part_number: C1005X7R1H104K050BE; Automotive Alternate_mfr_part_number: CGA2B3X7R1H104K050BB; Project: J7_CP; Wattage: NA; Customs_HS_Code: 85322990; Custom_Duty: 15%; Value: 0.1uF; Footprint Ref: CAP0402_0-75; Library Ref: CAP; Mfr_name: MURATA; Tolerance: 10%; Package: 0402; Distributor_name: DIGIKEY; Distributor_part_number: 490-10700-1-ND; Height: 0.55MM; Weight: 3.1mg; Temperature: -55°C+125°C; Datasheet: Y:\MIS_DATABASE\DATASHEETS\CAPACITORS\GRM155R71H104KE14.PDF; Crtd /date: ALVY/211020; Chkd/date: MANIRAJA/261020; MECHANICAL 3D STEP FILE: CAP0402_0-75; Library Path: Y:\MIS_DATABASE\Library\ALTIUM_TOOL\SCHEMATICS_PARTS\MS_DISCRETE_Library.schlib; Footprint Path: Y:\MIS_DATABASE\Library\ALTIUM_TOOL\PCB_FOOTPRINTS\Altium_Footprint_Lib.PcbLib; Automotive Alternate_mfr_name: TDK; PCB Footprint: CAP0402_0-75
C540 = CAP_Dup1: CAP CERAMIC 0.1uF 6.3V 10% X7S AUTO 0201; Part Reference: C540; Part_type: CAPACITORS\CERAMIC; Mfr_part_number: GCM033C70J104KE02D; Mfr_name: MURATA; Mistral Part No: 120018100001-R; Custom_Duty: 15%; Customs_HS_Code: 85322990; Wattage: NA; Project: TI_J7_SVB-DUT; Value: 0.1uF; PCB Footprint: CAP0201_0-5; Footprint Path: Y:\MIS_DATABASE\Library\ALTIUM_TOOL\PCB_FOOTPRINTS\Altium_Footprint_Lib.PcbLib; Library Path: Y:\MIS_DATABASE\Library\ALTIUM_TOOL\SCHEMATICS_PARTS\MS_DISCRETE_Library.schlib; MECHANICAL 3D STEP FILE: CAP0201_0-5; Chkd/date: MANIRAJA/011018; Crtd /date: MANIRAJA/011018; Datasheet: Y:\MIS_DATABASE\DATASHEETS\CAPACITORS\MURATA-GCM-SER.PDF; Temperature: -55°C+125°C; Weight: NA; Height: 0.33MM; Library Ref: CAP; Distributor_part_number: NA; Distributor_name: NA; Tolerance: 10%; Footprint Ref: CAP0201_0-5; Manufacturer: MURATA
C600 = CAP_Dup1: CAP CERAMIC 0.1uF 6.3V 10% X7S AUTO 0201; Part Reference: C600; Mistral Part No: 120018100001-R; Mfr_name: MURATA; Mfr_part_number: GCM033C70J104KE02D; Part_type: CAPACITORS\CERAMIC; Project: TI_J7_SVB-DUT; Wattage: NA; Customs_HS_Code: 85322990; Custom_Duty: 15%; Value: 0.1uF; PCB Footprint: CAP0201_0-5; Footprint Ref: CAP0201_0-5; Tolerance: 10%; Distributor_name: NA; Distributor_part_number: NA; Library Ref: CAP; Height: 0.33MM; Weight: NA; Temperature: -55°C+125°C; Datasheet: Y:\MIS_DATABASE\DATASHEETS\CAPACITORS\MURATA-GCM-SER.PDF; Crtd /date: MANIRAJA/011018; Chkd/date: MANIRAJA/011018; MECHANICAL 3D STEP FILE: CAP0201_0-5; Library Path: Y:\MIS_DATABASE\Library\ALTIUM_TOOL\SCHEMATICS_PARTS\MS_DISCRETE_Library.schlib; Footprint Path: Y:\MIS_DATABASE\Library\ALTIUM_TOOL\PCB_FOOTPRINTS\Altium_Footprint_Lib.PcbLib; Manufacturer: MURATA
C620 = CAP_Dup1: CAP CERAMIC 0.1uF 6.3V 10% X7S AUTO 0201; Part Reference: C620; Mistral Part No: 120018100001-R; Mfr_name: MURATA; Mfr_part_number: GCM033C70J104KE02D; Part_type: CAPACITORS\CERAMIC; Project: TI_J7_SVB-DUT; Wattage: NA; Customs_HS_Code: 85322990; Custom_Duty: 15%; Value: 0.1uF; PCB Footprint: CAP0201_0-5; Footprint Ref: CAP0201_0-5; Tolerance: 10%; Distributor_name: NA; Distributor_part_number: NA; Library Ref: CAP; Height: 0.33MM; Weight: NA; Temperature: -55°C+125°C; Datasheet: Y:\MIS_DATABASE\DATASHEETS\CAPACITORS\MURATA-GCM-SER.PDF; Crtd /date: MANIRAJA/011018; Chkd/date: MANIRAJA/011018; MECHANICAL 3D STEP FILE: CAP0201_0-5; Library Path: Y:\MIS_DATABASE\Library\ALTIUM_TOOL\SCHEMATICS_PARTS\MS_DISCRETE_Library.schlib; Footprint Path: Y:\MIS_DATABASE\Library\ALTIUM_TOOL\PCB_FOOTPRINTS\Altium_Footprint_Lib.PcbLib; Manufacturer: MURATA
C664 = CAP_Dup1: CAP CERAMIC 0.1uF 50V 10% X7R 0402; Part Reference: C664; Automotive Alternate_mfr_part_number: CGA2B3X7R1H104K050BB; Automotive Alternate_mfr_name: TDK; Direct Alternate_mfr_part_number: C1005X7R1H104K050BE; Part_type: CAPACITORS\CERAMIC; Mfr_part_number: GRM155R71H104KE14D; Mfr_name: MURATA; Mistral Part No: 120011100014-R; Custom_Duty: 15%; Customs_HS_Code: 85322990; Wattage: NA; Project: J7_CP; Value: 0.1uF; PCB Footprint: CAP0402_0-75; Direct Alternate_mfr_name: TDK; Footprint Path: Y:\MIS_DATABASE\Library\ALTIUM_TOOL\PCB_FOOTPRINTS\Altium_Footprint_Lib.PcbLib; Library Path: Y:\MIS_DATABASE\Library\ALTIUM_TOOL\SCHEMATICS_PARTS\MS_DISCRETE_Library.schlib; MECHANICAL 3D STEP FILE: CAP0402_0-75; Chkd/date: MANIRAJA/261020; Crtd /date: ALVY/211020; Datasheet: Y:\MIS_DATABASE\DATASHEETS\CAPACITORS\GRM155R71H104KE14.PDF; Temperature: -55°C+125°C; Weight: 3.1mg; Height: 0.55MM; Distributor_part_number: 490-10700-1-ND; Distributor_name: DIGIKEY; Package: 0402; Tolerance: 10%; Library Ref: CAP; Footprint Ref: CAP0402_0-75; Manufacturer: MURATA
R158 = RESISTOR_Dup2: RES 0E 1/4W JUMPER 0603 (HP); Part Reference: R158; Mistral Part No: 110012010013-R; Mfr_name: VISHAY; Mfr_part_number: CRCW06030000Z0EAHP; Part_type: RESISTORS\FIXED; Project: NA10NG; Tolerance: NA; Customs_HS_Code: 85332119; Custom_Duty: 15%; Remarks: This part is pulse proof, high power; Value: 0E; PCB Footprint: RES0603_0-75; Footprint Ref: RES0603_0-75; Voltage: NA; Wattage: 1/4 W; Package: 0603; Distributor_name: DIGIKEY; Distributor_part_number: 541-0.0SBCT-ND; Library Ref: RESISTOR; Height: 0.55MM; Weight: 2mg; Temperature: -55°C+155°C; Datasheet: Y:\MIS_DATABASE\DATASHEETS\RESISTORS\CRCWXXX-HP_SEP16.PDF; Crtd /date: CHAITHANYA/170112; Chkd/date: USMAN/170112; MECHANICAL 3D STEP FILE: RES0603_0-75; Library Path: Y:\MIS_DATABASE\Library\ALTIUM_TOOL\SCHEMATICS_PARTS\MS_DISCRETE_Library.schlib; Footprint Path: Y:\MIS_DATABASE\Library\ALTIUM_TOOL\PCB_FOOTPRINTS\Altium_Footprint_Lib.PcbLib; Manufacturer: VISHAY
R159 = RESISTOR_Dup2: RES 10K 1/16W 5% 0402; Part Reference: R159; Part_type: RESISTORS\FIXED; Mfr_part_number: RC0402JR-0710KL; Mfr_name: YAGEO AMERICA; Mistral Part No: 110011060021-R; Custom_Duty: 15%; Customs_HS_Code: 85332119; Voltage: NA; Project: HSE; Value: 10K; MECHANICAL 3D STEP FILE: RES0402_0-5; Chkd/date: VASANTHA/061216; Crtd /date: MAZHAR/230805; Datasheet: Y:\MIS_DATABASE\DATASHEETS\RESISTORS\RCXXXXL-SER_MAR18.PDF; Temperature: -55°C+155°C; Weight: 0.65mg; Height: 0.40MM; Distributor_part_number: 311-10KJRCT-ND; Distributor_name: DIGIKEY; Package: 0402; Wattage: 1/16W; Tolerance: 5%; Library Ref: RESISTOR; Footprint Ref: RES0402_0-5; Library Path: Y:\MIS_DATABASE\Library\ALTIUM_TOOL\SCHEMATICS_PARTS\MS_DISCRETE_Library.schlib; Footprint Path: Y:\MIS_DATABASE\Library\ALTIUM_TOOL\PCB_FOOTPRINTS\Altium_Footprint_Lib.PcbLib; Manufacturer: YAGEO AMERICA; PCB Footprint: RES0402_0-5
R160 = RESISTOR_Dup2: RES 10K 1/16W 5% 0402; Part Reference: R160; Mistral Part No: 110011060021-R; Mfr_name: YAGEO AMERICA; Mfr_part_number: RC0402JR-0710KL; Part_type: RESISTORS\FIXED; Project: HSE; Voltage: NA; Customs_HS_Code: 85332119; Custom_Duty: 15%; Value: 10K; Footprint Path: Y:\MIS_DATABASE\Library\ALTIUM_TOOL\PCB_FOOTPRINTS\Altium_Footprint_Lib.PcbLib; Library Path: Y:\MIS_DATABASE\Library\ALTIUM_TOOL\SCHEMATICS_PARTS\MS_DISCRETE_Library.schlib; Footprint Ref: RES0402_0-5; Library Ref: RESISTOR; Tolerance: 5%; Wattage: 1/16W; Package: 0402; Distributor_name: DIGIKEY; Distributor_part_number: 311-10KJRCT-ND; Height: 0.40MM; Weight: 0.65mg; Temperature: -55°C+155°C; Datasheet: Y:\MIS_DATABASE\DATASHEETS\RESISTORS\RCXXXXL-SER_MAR18.PDF; Crtd /date: MAZHAR/230805; Chkd/date: VASANTHA/061216; MECHANICAL 3D STEP FILE: RES0402_0-5; Manufacturer: YAGEO AMERICA; PCB Footprint: RES0402_0-5
R171 = RESISTOR_Dup2: RES 0E 1/4W JUMPER 0603 (HP); Part Reference: R171; Mistral Part No: 110012010013-R; Mfr_name: VISHAY; Mfr_part_number: CRCW06030000Z0EAHP; Part_type: RESISTORS\FIXED; Project: NA10NG; Tolerance: NA; Customs_HS_Code: 85332119; Custom_Duty: 15%; Remarks: This part is pulse proof, high power; Value: 0E; PCB Footprint: RES0603_0-75; Footprint Ref: RES0603_0-75; Voltage: NA; Wattage: 1/4 W; Package: 0603; Distributor_name: DIGIKEY; Distributor_part_number: 541-0.0SBCT-ND; Library Ref: RESISTOR; Height: 0.55MM; Weight: 2mg; Temperature: -55°C+155°C; Datasheet: Y:\MIS_DATABASE\DATASHEETS\RESISTORS\CRCWXXX-HP_SEP16.PDF; Crtd /date: CHAITHANYA/170112; Chkd/date: USMAN/170112; MECHANICAL 3D STEP FILE: RES0603_0-75; Library Path: Y:\MIS_DATABASE\Library\ALTIUM_TOOL\SCHEMATICS_PARTS\MS_DISCRETE_Library.schlib; Footprint Path: Y:\MIS_DATABASE\Library\ALTIUM_TOOL\PCB_FOOTPRINTS\Altium_Footprint_Lib.PcbLib; Manufacturer: VISHAY
R184 = RESISTOR_Dup2: RES 0E 1/10W JUMPER 0402; Part Reference: R184; Manufacturer: PANASONIC-ECG; Mistral Part No: 110018030052-R; Mfr_part_number: ERJ-2GE0R00X; Part_type: RESISTORS\FIXED; IBISSP_MODLES: VALUE REPEATING 2 TIME; Project: AEGIS POM; Tolerance: NA; Customs_HS_Code: 85332119; Custom_Duty: 15%; Value: 0E; PCB Footprint: RES0402_0-5; MECHANICAL 3D STEP FILE: RES0402_0-5; Mfr_name: PANASONIC-ECG; Voltage: NA; Wattage: 1/10W; Package: 0402; Distributor_name: DIGIKEY; Distributor_part_number: P0.0JCT-ND; Height: 0.40MM; Weight: 0.8mg; Temperature: -55°C+155°C; Datasheet: Y:\MIS_DATABASE\DATASHEETS\RESISTORS\PAN-ERJSER_NOV17.PDF; Crtd /date: NAVEED/201014; Chkd/date: VASANTHA/061216; Library Ref: RESISTOR; Footprint Ref: RES0402_0-5; Library Path: Y:\MIS_DATABASE\Library\ALTIUM_TOOL\SCHEMATICS_PARTS\MS_DISCRETE_Library.schlib; Footprint Path: Y:\MIS_DATABASE\Library\ALTIUM_TOOL\PCB_FOOTPRINTS\Altium_Footprint_Lib.PcbLib
R191 = RESISTOR_Dup2: RES 4.7K 1/16W 5% 0402; Part Reference: R191; Manufacturer: YAGEO AMERICA; Part_type: RESISTORS\FIXED; Mfr_part_number: RC0402JR-074K7L; Mistral Part No: 110011060001-R; Custom_Duty: 15%; Customs_HS_Code: 85332119; Voltage: NA; Project: TMDXCSK368; Value: 4.7K; PCB Footprint: RES0402_0-5; Footprint Path: Y:\MIS_DATABASE\Library\ALTIUM_TOOL\PCB_FOOTPRINTS\Altium_Footprint_Lib.PcbLib; Library Path: Y:\MIS_DATABASE\Library\ALTIUM_TOOL\SCHEMATICS_PARTS\MS_DISCRETE_Library.schlib; Footprint Ref: RES0402_0-5; Library Ref: RESISTOR; Chkd/date: VASANTHA/130516; Crtd /date: VASANTHA/130516; Datasheet: Y:\MIS_DATABASE\DATASHEETS\RESISTORS\RCXXXXL-SER_MAR18.PDF; Temperature: -55°C+155°C; Weight: 0.65mg; Height: 0.40MM; Distributor_part_number: 311-4.7KJRCT-ND; Distributor_name: DIGIKEY; Package: 0402; Wattage: 1/16W; Tolerance: 5%; Mfr_name: YAGEO AMERICA; MECHANICAL 3D STEP FILE: RES0402_0-5
R198 = RESISTOR_Dup2: RES 10K 1/16W 5% 0402; Part Reference: R198; Mistral Part No: 110011060021-R; Mfr_name: YAGEO AMERICA; Mfr_part_number: RC0402JR-0710KL; Part_type: RESISTORS\FIXED; Project: HSE; Voltage: NA; Customs_HS_Code: 85332119; Custom_Duty: 15%; Value: 10K; Footprint Path: Y:\MIS_DATABASE\Library\ALTIUM_TOOL\PCB_FOOTPRINTS\Altium_Footprint_Lib.PcbLib; Library Path: Y:\MIS_DATABASE\Library\ALTIUM_TOOL\SCHEMATICS_PARTS\MS_DISCRETE_Library.schlib; Footprint Ref: RES0402_0-5; Library Ref: RESISTOR; Tolerance: 5%; Wattage: 1/16W; Package: 0402; Distributor_name: DIGIKEY; Distributor_part_number: 311-10KJRCT-ND; Height: 0.40MM; Weight: 0.65mg; Temperature: -55°C+155°C; Datasheet: Y:\MIS_DATABASE\DATASHEETS\RESISTORS\RCXXXXL-SER_MAR18.PDF; Crtd /date: MAZHAR/230805; Chkd/date: VASANTHA/061216; MECHANICAL 3D STEP FILE: RES0402_0-5; Manufacturer: YAGEO AMERICA; PCB Footprint: RES0402_0-5
R199 = RESISTOR_Dup2: RES 10K 1/16W 5% 0402; Part Reference: R199; Mistral Part No: 110011060021-R; Mfr_name: YAGEO AMERICA; Mfr_part_number: RC0402JR-0710KL; Part_type: RESISTORS\FIXED; Project: HSE; Voltage: NA; Customs_HS_Code: 85332119; Custom_Duty: 15%; Value: 10K; Footprint Path: Y:\MIS_DATABASE\Library\ALTIUM_TOOL\PCB_FOOTPRINTS\Altium_Footprint_Lib.PcbLib; Library Path: Y:\MIS_DATABASE\Library\ALTIUM_TOOL\SCHEMATICS_PARTS\MS_DISCRETE_Library.schlib; Footprint Ref: RES0402_0-5; Library Ref: RESISTOR; Tolerance: 5%; Wattage: 1/16W; Package: 0402; Distributor_name: DIGIKEY; Distributor_part_number: 311-10KJRCT-ND; Height: 0.40MM; Weight: 0.65mg; Temperature: -55°C+155°C; Datasheet: Y:\MIS_DATABASE\DATASHEETS\RESISTORS\RCXXXXL-SER_MAR18.PDF; Crtd /date: MAZHAR/230805; Chkd/date: VASANTHA/061216; MECHANICAL 3D STEP FILE: RES0402_0-5; Manufacturer: YAGEO AMERICA; PCB Footprint: RES0402_0-5
TP46 = TESTPOINT_Dup1: TESTPOINT CIR 30 SMD; Part Reference: TP46; Manufacturer: LOCAL; Mistral Part No: 130009030930; Project: BT MODULE_CSRBC04; Tolerance: NA; Value: TP30_SMD; PCB Footprint: TP30_SMD; Footprint Ref: TP30_SMD; Library Ref: TESTPOINT; Mfr_name: LOCAL; Mfr_part_number: TP30_SMD; Part_type: TESTPOINT; Voltage: NA; Wattage: NA; Package: SMD; Distributor_name: NA; Distributor_part_number: NA; Height: NA; Weight: NA; Temperature: NA; Datasheet: NA; Crtd /date: MAZHAR/171006; Chkd/date: SHREESHAIL/171006; MECHANICAL 3D STEP FILE: NA; Library Path: Y:\MIS_DATABASE\Library\ALTIUM_TOOL\SCHEMATICS_PARTS\MS_DISCRETE_Library.schlib; Footprint Path: Y:\MIS_DATABASE\Library\ALTIUM_TOOL\PCB_FOOTPRINTS\Altium_Footprint_Lib.PcbLib; RoHS: NA; Customs_HS_Code: NA; Custom_Duty: NA
TP49 = TESTPOINT_Dup1: TESTPOINT CIR 30 SMD; Part Reference: TP49; Manufacturer: LOCAL; Mistral Part No: 130009030930; MECHANICAL 3D STEP FILE: NA; Project: BT MODULE_CSRBC04; Value: TP30_SMD; PCB Footprint: TP30_SMD; RoHS: NA; Footprint Path: Y:\MIS_DATABASE\Library\ALTIUM_TOOL\PCB_FOOTPRINTS\Altium_Footprint_Lib.PcbLib; Library Path: Y:\MIS_DATABASE\Library\ALTIUM_TOOL\SCHEMATICS_PARTS\MS_DISCRETE_Library.schlib; Chkd/date: SHREESHAIL/171006; Crtd /date: MAZHAR/171006; Datasheet: NA; Temperature: NA; Weight: NA; Height: NA; Distributor_part_number: NA; Distributor_name: NA; Package: SMD; Wattage: NA; Voltage: NA; Tolerance: NA; Part_type: TESTPOINT; Mfr_part_number: TP30_SMD; Mfr_name: LOCAL; Library Ref: TESTPOINT; Footprint Ref: TP30_SMD; Customs_HS_Code: NA; Custom_Duty: NA
U28 = J7AHPSoC-EVM_BGA1414: IC AM69 SoC EVM MICROPROCESSOR BGA1414; Part Reference: U28; Mistral Part No: 141230020002; Mfr_name: TEXAS INSTRUMENTS; Part_type: ICS\DIGITAL\MICROPROCESSOR; SPLIT_INST: TRUE; SWAP_INFO: (S1+S2+S3+S4+S5+S6+S7+S8+S9+S10+S11+S12+S13+S14+S15+S16+S17+S18+S19+S20+S21+S22+S23+S24+S25+S26); Project: TI_J7AHP SK_BRD; Tolerance: NA; Customs_HS_Code: 85423100; Custom_Duty: 15%; Value: XJ784S45AALY; PCB Footprint: BGA1414_31-49_1230X1230_2-7; Footprint Ref: BGA1414_31-49_1230X1230_2-7; Mfr_part_number: XJ784S45AALY; Voltage: NA; Wattage: NA; Package: BGA1414; Distributor_name: NA; Distributor_part_number: NA; Library Ref: J7AHPSoC-EVM_BGA1414; Height: 2.70MM; Weight: NA; Temperature: NA; Datasheet: Y:\MIS_DATABASE\DATASHEETS\ICS\DIGITAL\MICROCONTROLLER\J7AHP-SoC-EVM.PDF; Crtd /date: ALVY/141221; Chkd/date: MANIRAJA/151221; RoHS: NA; MECHANICAL 3D STEP FILE: BGA1414_31-49_1230X1230_2-7; Library Path: Y:\MIS_DATABASE\Library\ALTIUM_TOOL\SCHEMATICS_PARTS\MS_MICROPROCESSOR_Library.schlib; Footprint Path: Y:\MIS_DATABASE\Library\ALTIUM_TOOL\PCB_FOOTPRINTS\Altium_Footprint_Lib.PcbLib; Manufacturer: TEXAS INSTRUMENTS
U37 = SN74CB3Q3257PWR_TSSOP16: IC 4BIT 1-OF-2 FET MULTIPLEXER/DEMULTIPLEXER TSSOP16; Part Reference: U37; Part_type: ICS\DIGITAL\COMBINATIONAL; Mfr_name: TEXAS INSTRUMENTS; Mistral Part No: 141009030117-R; Custom_Duty: 15%; Customs_HS_Code: 85423100; Project: OMAP_EVM; Value: SN74CB3Q3257PWR; RoHS: Sb/ Br FREE; Chkd/date: SUHAS/251010; Crtd /date: USMAN/060109; Datasheet: Y:\MIS_DATABASE\DATASHEETS\ICS\DIGITAL\COMBINATIONAL\SN74CB3Q3257.PDF; Temperature: -40°C+85°C; Height: 1.20MM; Library Ref: SN74CB3Q3257PWR_TSSOP16; Distributor_part_number: 296-19138-1-ND; Distributor_name: DIGIKEY; Package: TSSOP16; Mfr_part_number: SN74CB3Q3257PWR; Manufacturer: TEXAS INSTRUMENTS; PCB Footprint: TSSOP16_25-59_205X180
U89 = SN74CB3Q3257PWR_TSSOP16: IC 4BIT 1-OF-2 FET MULTIPLEXER/DEMULTIPLEXER TSSOP16; Part Reference: U89; Part_type: ICS\DIGITAL\COMBINATIONAL; Mfr_name: TEXAS INSTRUMENTS; Mistral Part No: 141009030117-R; Custom_Duty: 15%; Customs_HS_Code: 85423100; Project: OMAP_EVM; Value: SN74CB3Q3257PWR; PCB Footprint: TSSOP16_25-59_205X180; RoHS: Sb/ Br FREE; Chkd/date: SUHAS/251010; Crtd /date: USMAN/060109; Datasheet: Y:\MIS_DATABASE\DATASHEETS\ICS\DIGITAL\COMBINATIONAL\SN74CB3Q3257.PDF; Temperature: -40°C+85°C; Height: 1.20MM; Library Ref: SN74CB3Q3257PWR_TSSOP16; Distributor_part_number: 296-19138-1-ND; Distributor_name: DIGIKEY; Package: TSSOP16; Mfr_part_number: SN74CB3Q3257PWR; Manufacturer: TEXAS INSTRUMENTS

## Sheet 21. SOC USB2.0.SchDoc: SOC - USB 2.0
size 513 x 386 mm; Project: PROC154E2(001)_SK_AM69; Issue: 1.0; RevCode: E3; Page Create Date: March  8, 1995; Variant Name: Core Design; Schematic Page Number: 21; Page Number: 21; Page Size: C; Comment: MISTRAL_TITLEBLK_CSIZE_1; Page Count: 62; Schematic Page Count: 62; Name: PROC154E2 001 SK AM69; DsnPath: C:\Users\danie\Downloads\sprr466c\PROC154E3_RP\PROC154E3_SCH.DSN; SchematicName: SCHEMATIC1; PageName: 21. SOC USB2.0; PageSize: C; TopSchematic: True
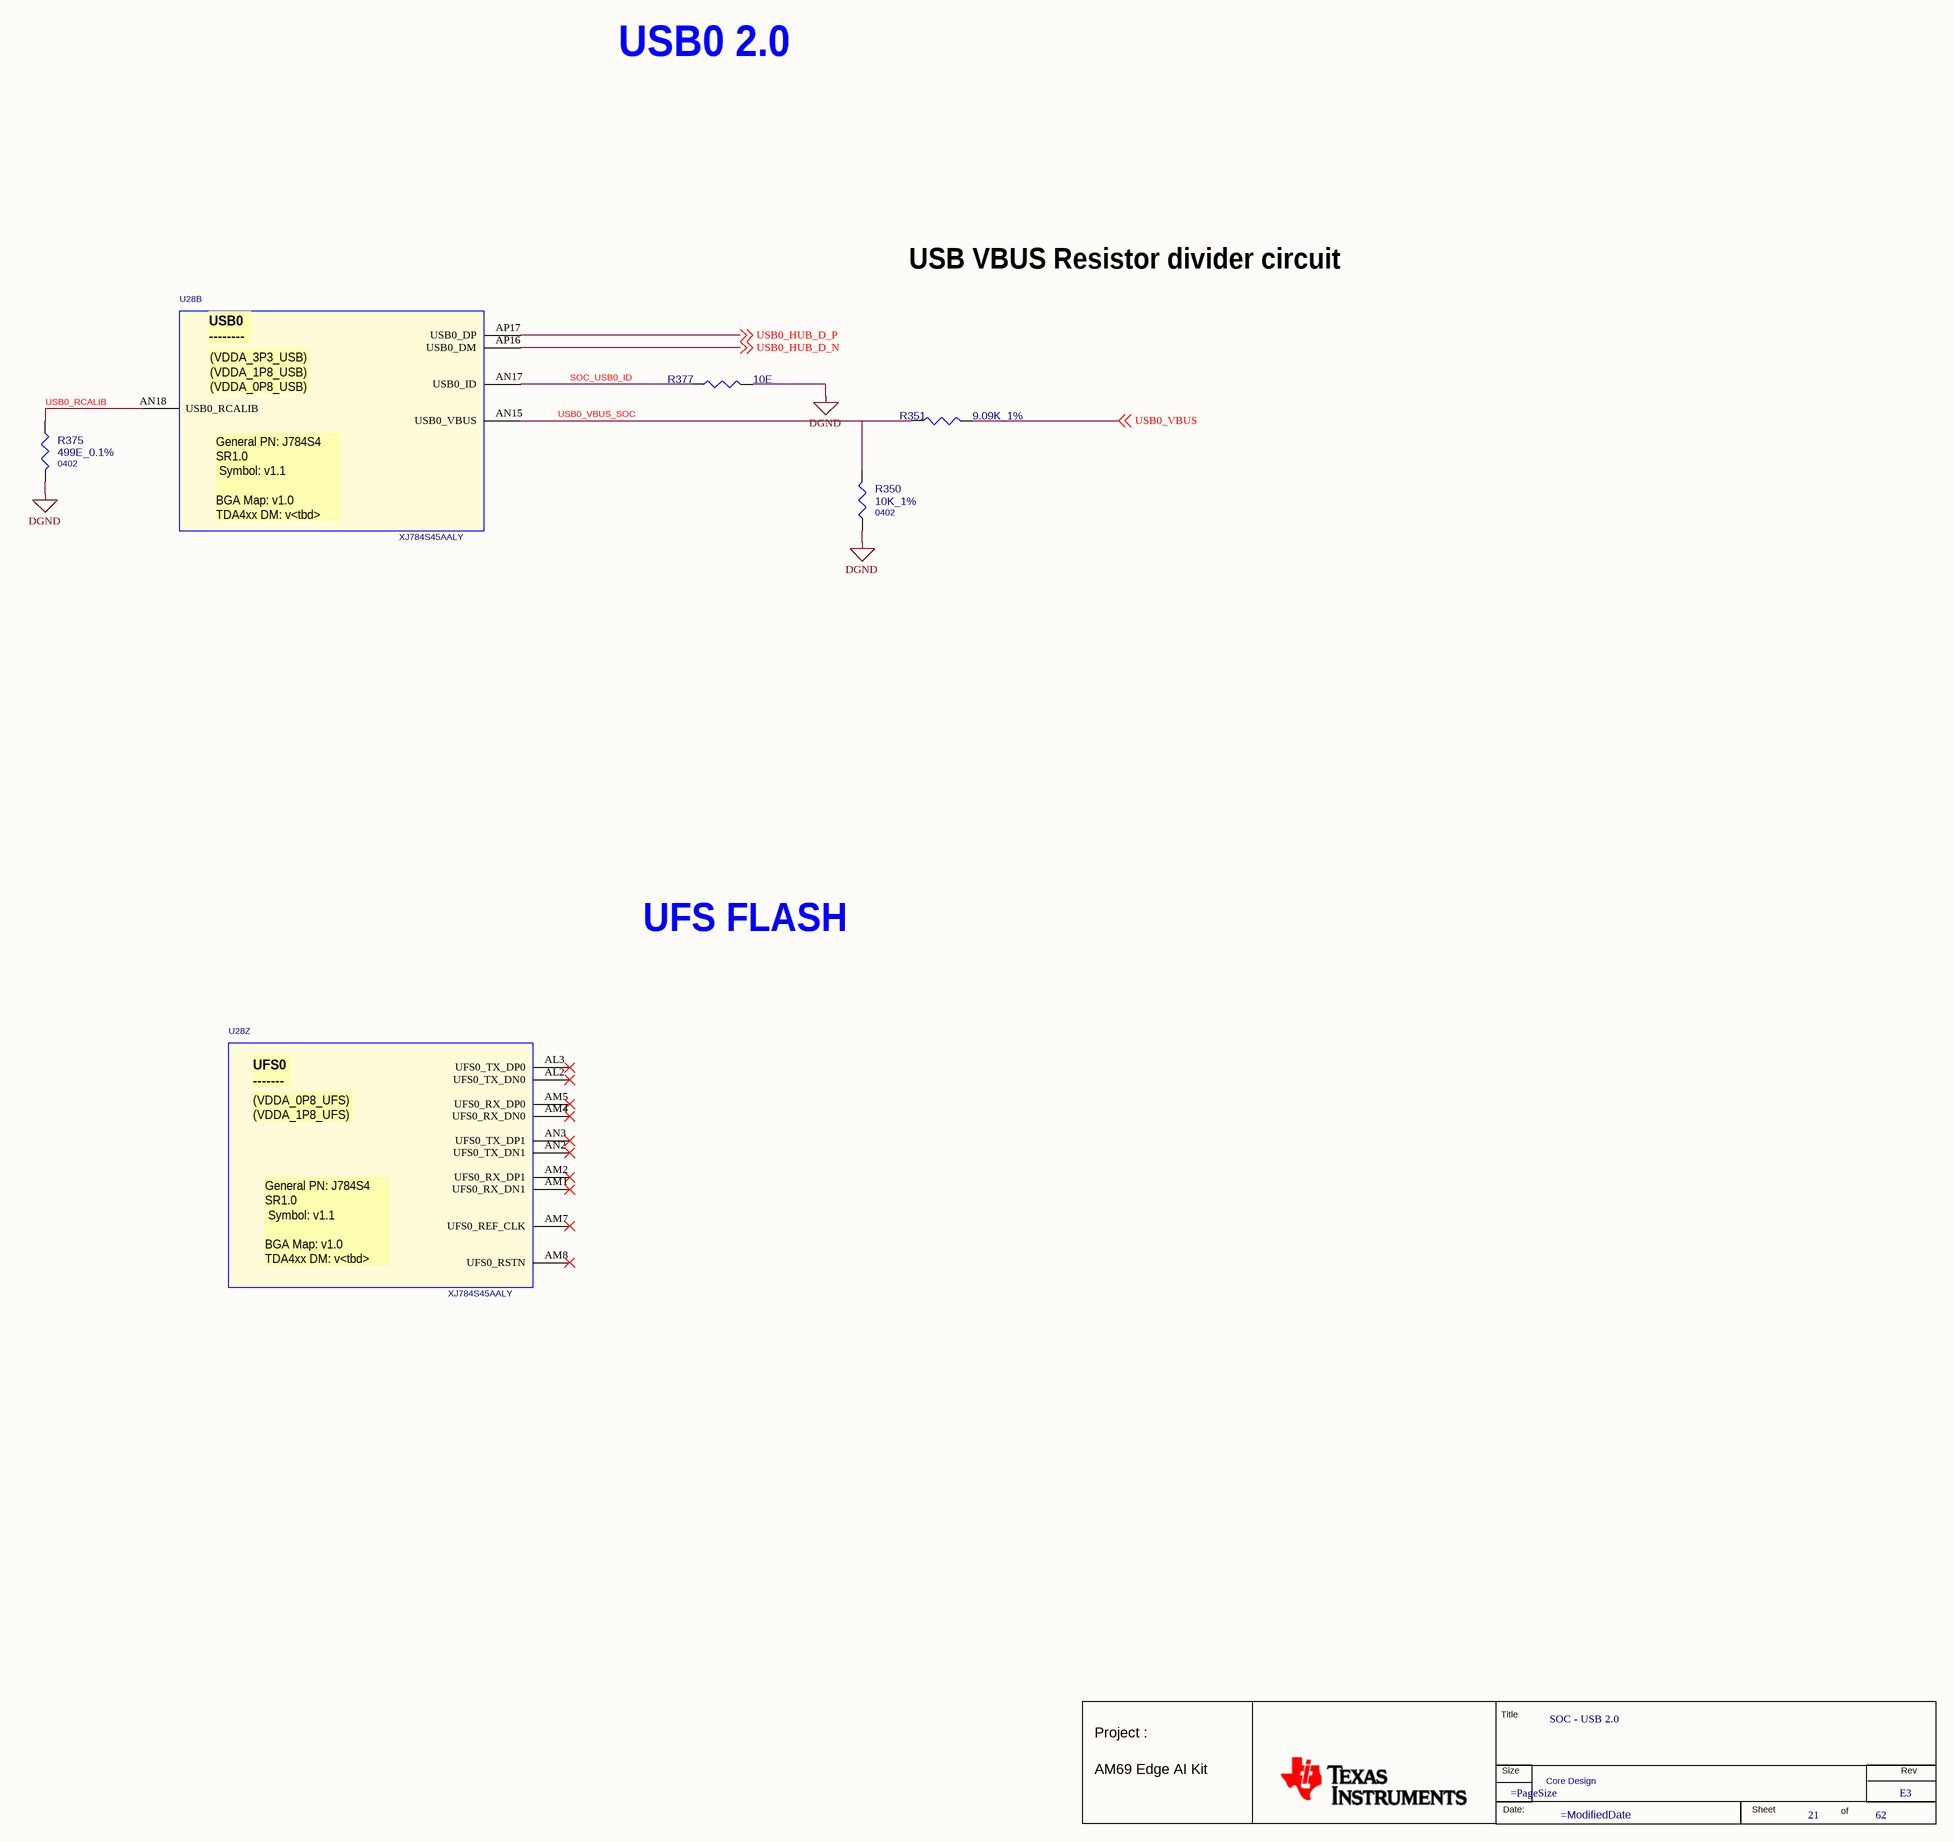
[diagram p31: 21. SOC USB2.0.SchDoc]

### Parts
(Parts that share a designator on the sheet are numbered #1, #2 ... from top to bottom, then left to right.)
*#21  RevCode: E3  Title: SOC - USB 2.0  Page Number: 21  Page Count: 62  Variant Name: Core Design  (hidden comment: MISTRAL_TITLEBLK_CSIZE_1)  (graphical)
R350  10K_1%  Package: 0402  [RES0402_0-5]
R351  9.09K_1%  [RES0402_0-5]
R375  499E_0.1%  Package: 0402  [RES0402_0-5]
R377  10E  [RES0402_0-5]
U28  XJ784S45AALY  [BGA1414_31-49_1230X1230_2-7]  (parts B,Z of 26)

### Nets
DGND: R350.1 R375.2 R377.2  [project net VDD_CPU_HCPS_GOSNS]
SOC_USB0_ID: R377.1 U28.AN17(USB0_ID)
USB0_HUB_D_N: U28.AP16(USB0_DM) ; off-sheet USB0_HUB_D_N
USB0_HUB_D_P: U28.AP17(USB0_DP) ; off-sheet USB0_HUB_D_P
USB0_RCALIB: R375.1 U28.AN18(USB0_RCALIB)
USB0_VBUS: R351.2 ; off-sheet USB0_VBUS  [project net TIMER_IO1]
USB0_VBUS_SOC: R350.2 R351.1 U28.AN15(USB0_VBUS)

Not connected (* = marked no-connect by the designer): U28 AL2(UFS0_TX_DN0)* AL3(UFS0_TX_DP0)* AM1(UFS0_RX_DN1)* AM2(UFS0_RX_DP1)* AM4(UFS0_RX_DN0)* AM5(UFS0_RX_DP0)* AM7(UFS0_REF_CLK)* AM8(UFS0_RSTN)* AN2(UFS0_TX_DN1)* AN3(UFS0_TX_DP1)*

### Notes on the sheet
- USB0 2.0
- USB VBUS Resistor divider circuit
- UFS FLASH
- (in symbol J7AHPSoC-EVM_BGA1414, part B) USB0 / --------; (VDDA_3P3_USB) / (VDDA_1P8_USB) / (VDDA_0P8_USB); General PN: J784S4 / SR1.0 / Symbol: v1.1 / BGA Map: v1.0 / TDA4xx DM: v<tbd>
- (in symbol J7AHPSoC-EVM_BGA1414, part Z) UFS0 / -------; (VDDA_0P8_UFS) / (VDDA_1P8_UFS); General PN: J784S4 / SR1.0 / Symbol: v1.1 / BGA Map: v1.0 / TDA4xx DM: v<tbd>
- (in symbol MISTRAL_TITLEBLK_CSIZE_1) Title; Project :; Size; Rev; AM69 Edge AI Kit; Date:; Sheet; of

### Library data of the parts
*#21 = MISTRAL_TITLEBLK_CSIZE_1: as *#19 on sheet 19. SOC MCU RGMII & MMC & ADCs; Page Create Date: March  8, 1995; Page Size: =PageSize; Page Modify Date: =ModifiedDate; Schematic Page Count: 62; Schematic Page Number: 21
R350 = RESISTOR_Dup2: RES 10K 1/16W 1% 0402; Part Reference: R350; Part_type: RESISTORS\FIXED; Mfr_part_number: RC0402FR-0710KL; Mfr_name: YAGEO AMERICA; Mistral Part No: 110015090015-R; Custom_Duty: 15%; Customs_HS_Code: 85332119; Voltage: NA; Project: VOCERA; Value: 10K_1%; PCB Footprint: RES0402_0-5; Footprint Path: Y:\MIS_DATABASE\Library\ALTIUM_TOOL\PCB_FOOTPRINTS\Altium_Footprint_Lib.PcbLib; Library Path: Y:\MIS_DATABASE\Library\ALTIUM_TOOL\SCHEMATICS_PARTS\MS_DISCRETE_Library.schlib; MECHANICAL 3D STEP FILE: RES0402_0-5; Chkd/date: VASANTHA/201216; Crtd /date: GEETHA/290506; Datasheet: Y:\MIS_DATABASE\DATASHEETS\RESISTORS\RCXXXXL-SER_MAR18.PDF; Temperature: -55°C+155°C; Weight: 0.65mg; Height: 0.40MM; Library Ref: RESISTOR; Distributor_part_number: 311-10.0KLRTR-ND; Distributor_name: DIGIKEY; Wattage: 1/16W; Tolerance: 1%; Footprint Ref: RES0402_0-5
R351 = RESISTOR_Dup2: RES 9.09K 1/16W 1% 0402; Part Reference: R351; Mistral Part No: 110011060006-R; Mfr_name: VISHAY; Mfr_part_number: CRCW04029K09FKED; Part_type: RESISTORS\FIXED; Project: TE_MODULE; Voltage: NA; Customs_HS_Code: 85332119; Custom_Duty: 15%; Value: 9.09K_1%; Footprint Ref: RES0402_0-5; Tolerance: 1%; Wattage: 1/16W; Package: 0402; Distributor_name: DIGIKEY; Distributor_part_number: 541-9.09KLCT-ND; Library Ref: RESISTOR; Height: 0.40MM; Weight: 0.65mg; Temperature: -55°C+155°C; Datasheet: Y:\MIS_DATABASE\DATASHEETS\RESISTORS\CRCW0603.PDF; Crtd /date: BAVISH/010611; Chkd/date: VASANTHA/281216; MECHANICAL 3D STEP FILE: RES0402_0-5; Library Path: Y:\MIS_DATABASE\Library\ALTIUM_TOOL\SCHEMATICS_PARTS\MS_DISCRETE_Library.schlib; Footprint Path: Y:\MIS_DATABASE\Library\ALTIUM_TOOL\PCB_FOOTPRINTS\Altium_Footprint_Lib.PcbLib; PCB Footprint: RES0402_0-5
R375 = RESISTOR_Dup2: RES 499E 1/16W 0.1% 0402; Part Reference: R375; Mistral Part No: 110021020006-R; Manufacturer: YAGEO AMERICA; Mfr_part_number: RT0402BRD07499RL; Part_type: RESISTORS\FIXED; Project: TI_AM62x SKEVM_BRD; Voltage: NA; Customs_HS_Code: 85332119; Custom_Duty: 15%; Value: 499E_0.1%; PCB Footprint: RES0402_0-5; Footprint Ref: RES0402_0-5; Tolerance: 0.1%; Wattage: 1/16W; Distributor_name: DIGIKEY; Distributor_part_number: YAG1440CT-ND; Library Ref: RESISTOR; Height: 0.35MM; Weight: 0.65mg; Temperature: -55°C+155°C; Datasheet: Y:\MIS_DATABASE\DATASHEETS\RESISTORS\YAGEO_RT-SERIES.PDF; Crtd /date: MANIRAJA/200921; Chkd/date: ALVY/200921; MECHANICAL 3D STEP FILE: RES0402_0-5; Library Path: Y:\MIS_DATABASE\Library\ALTIUM_TOOL\SCHEMATICS_PARTS\MS_DISCRETE_Library.schlib; Footprint Path: Y:\MIS_DATABASE\Library\ALTIUM_TOOL\PCB_FOOTPRINTS\Altium_Footprint_Lib.PcbLib; Mfr_name: YAGEO AMERICA
R377 = RESISTOR_Dup2: RES 10E 1/16W 5% 0402; Part Reference: R377; Mistral Part No: 110015080004-R; Mfr_name: YAGEO AMERICA; Mfr_part_number: RC0402JR-0710RL; Part_type: RESISTORS\FIXED; Project: PDLU; Voltage: NA; Customs_HS_Code: 85332119; Custom_Duty: 15%; Value: 10E; Footprint Ref: RES0402_0-5; Tolerance: 5%; Wattage: 1/16W; Package: 0402; Distributor_name: DIGIKEY; Distributor_part_number: 311-10JRCT-ND; Library Ref: RESISTOR; Height: 0.40MM; Weight: 0.65mg; Temperature: -55°C+155°C; Datasheet: Y:\MIS_DATABASE\DATASHEETS\RESISTORS\RCXXXXL-SER_MAR18.PDF; Crtd /date: JEBRAN/050815; Chkd/date: JEBRAN/050815; MECHANICAL 3D STEP FILE: RES0402_0-5; Library Path: Y:\MIS_DATABASE\Library\ALTIUM_TOOL\SCHEMATICS_PARTS\MS_DISCRETE_Library.schlib; Footprint Path: Y:\MIS_DATABASE\Library\ALTIUM_TOOL\PCB_FOOTPRINTS\Altium_Footprint_Lib.PcbLib; PCB Footprint: RES0402_0-5
U28 = J7AHPSoC-EVM_BGA1414: IC AM69 SoC EVM MICROPROCESSOR BGA1414; Part Reference: U28; Manufacturer: TEXAS INSTRUMENTS; Part_type: ICS\DIGITAL\MICROPROCESSOR; Mistral Part No: 141230020002; SPLIT_INST: TRUE; SWAP_INFO: (S1+S2+S3+S4+S5+S6+S7+S8+S9+S10+S11+S12+S13+S14+S15+S16+S17+S18+S19+S20+S21+S22+S23+S24+S25+S26); Custom_Duty: 15%; Customs_HS_Code: 85423100; Wattage: NA; Project: TI_J7AHP SK_BRD; Value: XJ784S45AALY; Footprint Path: Y:\MIS_DATABASE\Library\ALTIUM_TOOL\PCB_FOOTPRINTS\Altium_Footprint_Lib.PcbLib; Library Path: Y:\MIS_DATABASE\Library\ALTIUM_TOOL\SCHEMATICS_PARTS\MS_MICROPROCESSOR_Library.schlib; MECHANICAL 3D STEP FILE: BGA1414_31-49_1230X1230_2-7; RoHS: NA; Chkd/date: MANIRAJA/151221; Crtd /date: ALVY/141221; Datasheet: Y:\MIS_DATABASE\DATASHEETS\ICS\DIGITAL\MICROCONTROLLER\J7AHP-SoC-EVM.PDF; Temperature: NA; Weight: NA; Height: 2.70MM; Library Ref: J7AHPSoC-EVM_BGA1414; Distributor_part_number: NA; Distributor_name: NA; Package: BGA1414; Voltage: NA; Tolerance: NA; Mfr_part_number: XJ784S45AALY; Mfr_name: TEXAS INSTRUMENTS; Footprint Ref: BGA1414_31-49_1230X1230_2-7; PCB Footprint: BGA1414_31-49_1230X1230_2-7